# EAGLE design inktime (EAGLE 9.7.0)

## Sheet 1 of 2
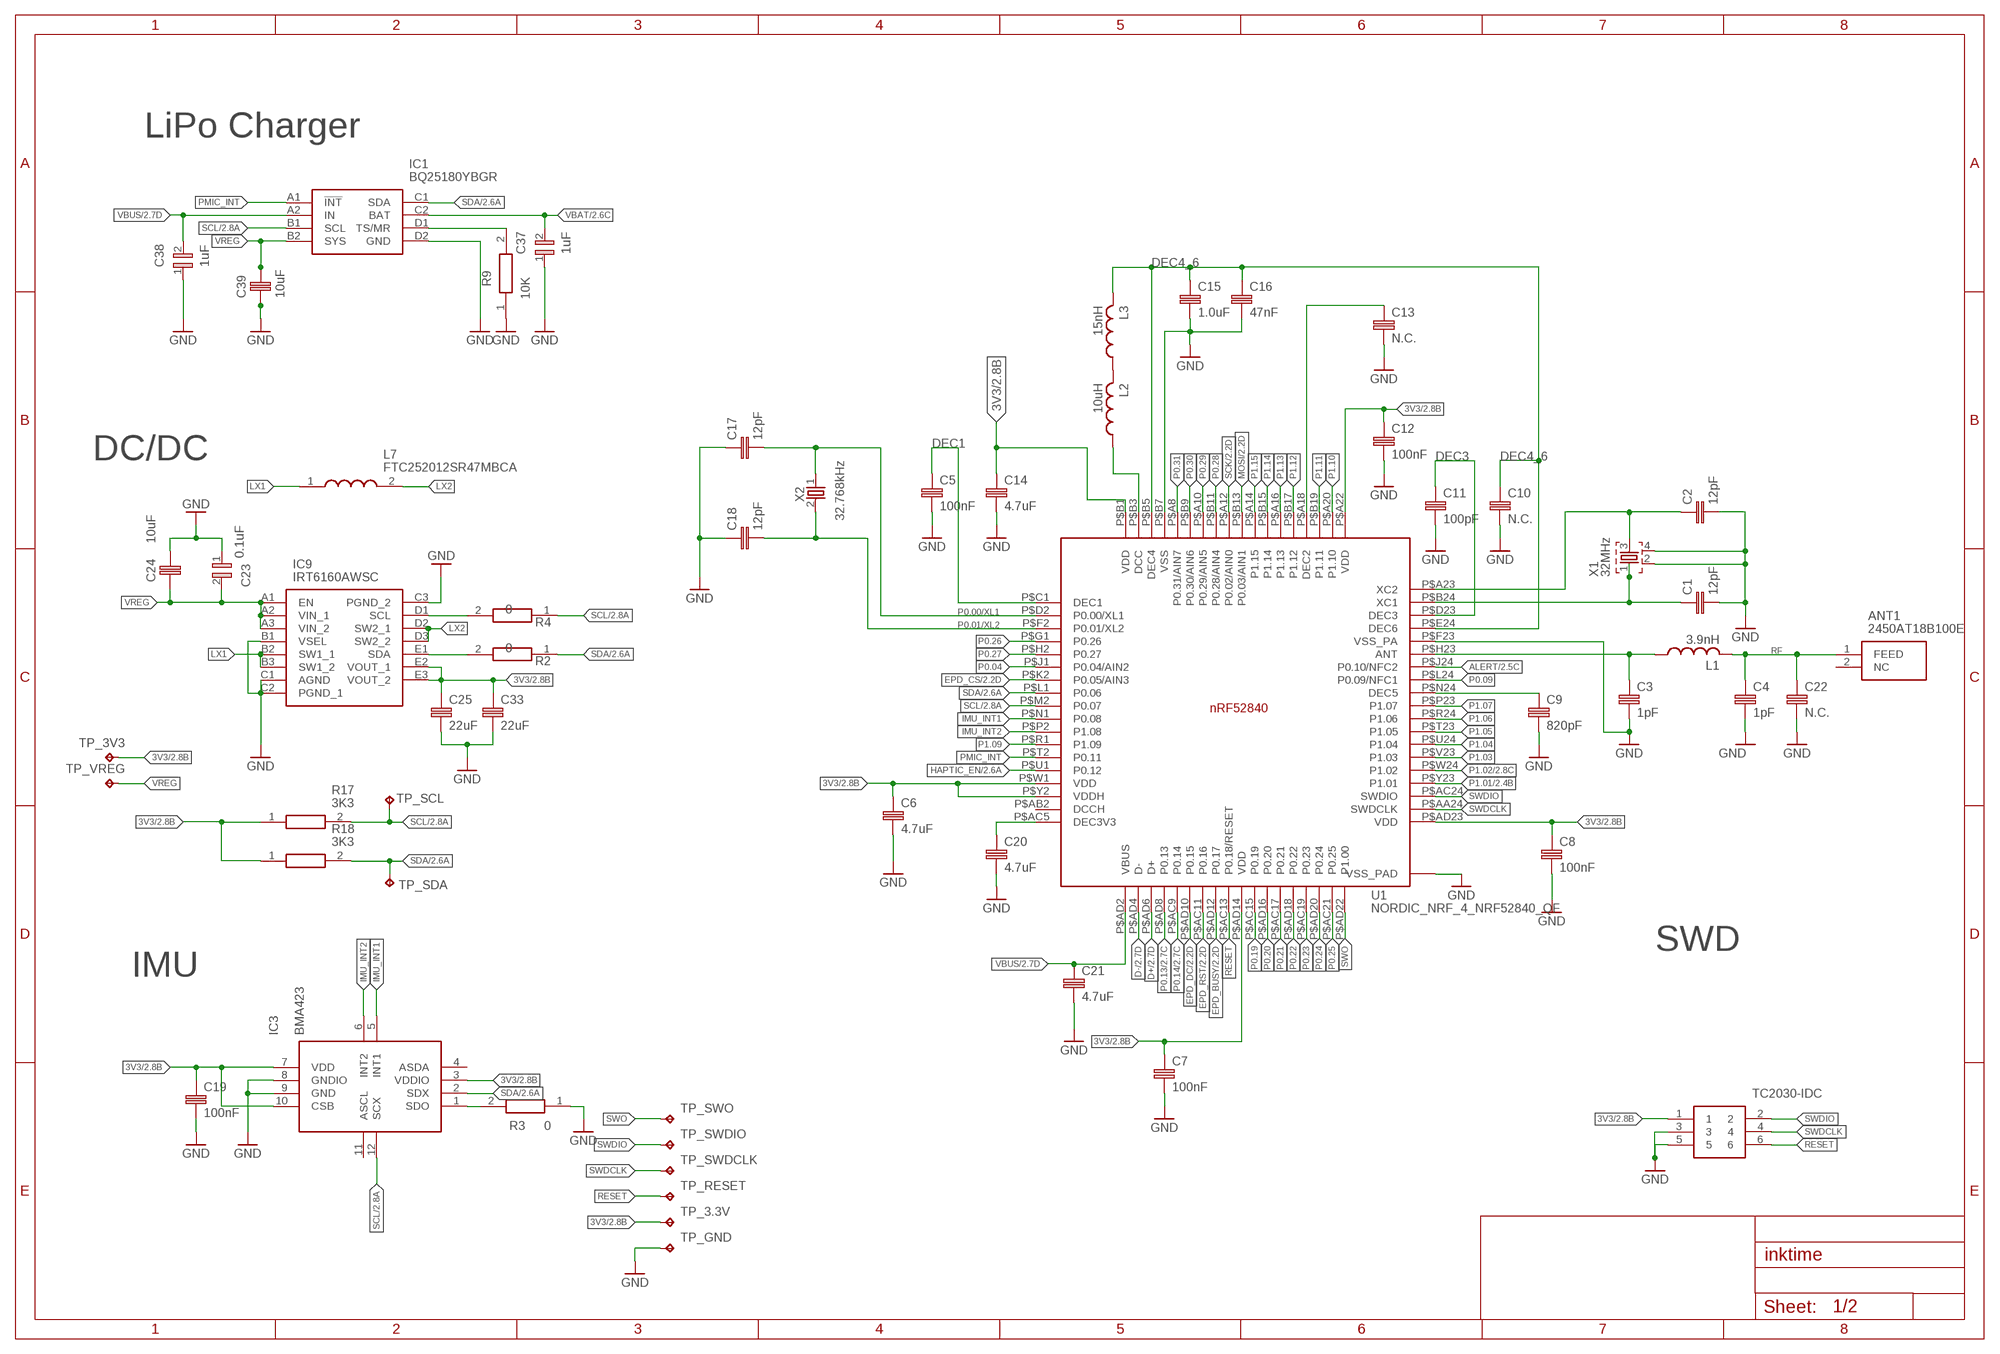
[diagram p0: schematic, sheet 1]

### Parts
ANT1  2450AT18B100E  2450AT18B100E_2450AT18B100E  [2450AT18B100E_ANTC3216X140N]
C1  12pF  NORDIC_NRF_3_CAPACITOR_0201_L  [NORDIC_NRF_3_RESC0201_L]
C2  12pF  NORDIC_NRF_3_CAPACITOR_0201_L  [NORDIC_NRF_3_RESC0201_L]
C3  1pF  NORDIC_NRF_3_CAPACITOR_0201_L  [NORDIC_NRF_3_RESC0201_L]
C4  1pF  NORDIC_NRF_3_CAPACITOR_0201_L  [NORDIC_NRF_3_RESC0201_L]
C5  100nF  NORDIC_NRF_3_CAPACITOR_0201_L  [NORDIC_NRF_3_RESC0201_L]
C6  4.7uF  NORDIC_NRF_3_CAPACITOR_0402_L  [NORDIC_NRF_3_RESC0402_L]
C7  100nF  NORDIC_NRF_3_CAPACITOR_0201_L  [NORDIC_NRF_3_RESC0201_L]
C8  100nF  NORDIC_NRF_3_CAPACITOR_0201_L  [NORDIC_NRF_3_RESC0201_L]
C9  820pF  NORDIC_NRF_3_CAPACITOR_0201_L  [NORDIC_NRF_3_RESC0201_L]
C10  N.C.  NORDIC_NRF_3_CAPACITOR_0201_L  [NORDIC_NRF_3_RESC0201_L]
C11  100pF  NORDIC_NRF_3_CAPACITOR_0201_L  [NORDIC_NRF_3_RESC0201_L]
C12  100nF  NORDIC_NRF_3_CAPACITOR_0201_L  [NORDIC_NRF_3_RESC0201_L]
C13  N.C.  NORDIC_NRF_3_CAPACITOR_0201_L  [NORDIC_NRF_3_RESC0201_L]
C14  4.7uF  NORDIC_NRF_3_CAPACITOR_0402_L  [NORDIC_NRF_3_RESC0402_L]
C15  1.0uF  NORDIC_NRF_3_CAPACITOR_0402_L  [NORDIC_NRF_3_RESC0402_L]
C16  47nF  NORDIC_NRF_3_CAPACITOR_0201_L  [NORDIC_NRF_3_RESC0201_L]
C17  12pF  NORDIC_NRF_3_CAPACITOR_0201_L  [NORDIC_NRF_3_RESC0201_L]
C18  12pF  NORDIC_NRF_3_CAPACITOR_0201_L  [NORDIC_NRF_3_RESC0201_L]
C19  100nF  NORDIC_NRF_3_CAPACITOR_0201_L  [NORDIC_NRF_3_RESC0201_L]
C20  4.7uF  NORDIC_NRF_3_CAPACITOR_0402_L  [NORDIC_NRF_3_RESC0402_L]
C21  4.7uF  NORDIC_NRF_3_CAPACITOR_0402_L  [NORDIC_NRF_3_RESC0402_L]
C22  N.C.  NORDIC_NRF_3_CAPACITOR_0201_L  [NORDIC_NRF_3_RESC0201_L]
C23  0.1uF  GRM011R60J152KE01L_2_GRM011R60J152KE01L  [GRM011R60J152KE01L_2_CAPC0201X13N]
C24  10uF  NORDIC_NRF_3_CAPACITOR_0402_L  [NORDIC_NRF_3_RESC0402_L]
C25  22uF  NORDIC_NRF_3_CAPACITOR_0402_L  [NORDIC_NRF_3_RESC0402_L]
C33  22uF  NORDIC_NRF_3_CAPACITOR_0402_L  [NORDIC_NRF_3_RESC0402_L]
C37  1uF  GRM011R60J152KE01L_2_GRM011R60J152KE01L  [GRM011R60J152KE01L_2_CAPC0201X13N]
C38  1uF  GRM011R60J152KE01L_2_GRM011R60J152KE01L  [GRM011R60J152KE01L_2_CAPC0201X13N]
C39  10uF  NORDIC_NRF_3_CAPACITOR_0402_L  [NORDIC_NRF_3_RESC0402_L]
IC1  BQ25180YBGR  BQ25180YBGR_BQ25180YBGR  [BQ25180YBGR_BGA8C40P2X4_100X155X50]
IC3  BMA423  BMA423_BMA423  [BMA423_BMA423]
IC9  IRT6160AWSC  RT6160AWSC_RT6160AWSC  [RT6160AWSC_BGA15C40P3X5_140X230X60]
J2  TC2030-IDC  TC2030-IDC_TC2030-IDC  [TC2030-IDC_TC2030IDC]
L1  3.9nH  NORDIC_NRF_2_INDUCTOR_0402_L  [NORDIC_NRF_2_RESC0402_L]
L2  10uH  NORDIC_NRF_2_INDUCTOR_0402_L  [NORDIC_NRF_2_RESC0402_L]
L3  15nH  NORDIC_NRF_2_INDUCTOR_0402_L  [NORDIC_NRF_2_RESC0402_L]
L7  FTC252012SR47MBCA  MLP2016SR47MT0S1_FTC252012SR47MBCA  [MLP2016SR47MT0S1_INDC2016X100N]
R2  0  ERA-1AEB3401C_CPF0201D7K68C1  [ERA-1AEB3401C_0201]
R3  0  CPF0201D7K68C1_CPF0201D7K68C1  [CPF0201D7K68C1_0201]
R4  0  ERA-1AEB3401C_CPF0201D7K68C1  [ERA-1AEB3401C_0201]
R9  10K  ERA-1AEB3401C_CPF0201D7K68C1  [ERA-1AEB3401C_0201]
R17  3K3  CPF0201D7K68C1_CPF0201D7K68C1  [CPF0201D7K68C1_0201]
R18  3K3  CPF0201D7K68C1_CPF0201D7K68C1  [CPF0201D7K68C1_0201]
TP_3.3V  HECTOR_WATCH_1_TPTP20R  [HECTOR_WATCH_1_TP20R]
TP_3V3  HECTOR_WATCH_1_TPTP20R  [HECTOR_WATCH_1_TP20R]
TP_GND  HECTOR_WATCH_1_TPTP20R  [HECTOR_WATCH_1_TP20R]
TP_RESET  HECTOR_WATCH_1_TPTP20R  [HECTOR_WATCH_1_TP20R]
TP_SCL  HECTOR_WATCH_1_TPTP20R  [HECTOR_WATCH_1_TP20R]
TP_SDA  HECTOR_WATCH_1_TPTP20R  [HECTOR_WATCH_1_TP20R]
TP_SWDCLK  HECTOR_WATCH_1_TPTP20R  [HECTOR_WATCH_1_TP20R]
TP_SWDIO  HECTOR_WATCH_1_TPTP20R  [HECTOR_WATCH_1_TP20R]
TP_SWO  HECTOR_WATCH_1_TPTP20R  [HECTOR_WATCH_1_TP20R]
TP_VREG  HECTOR_WATCH_1_TPTP20R  [HECTOR_WATCH_1_TP20R]
U1  NORDIC_NRF_4_NRF52840_QF  [NORDIC_NRF_4_AQFN50P700X700X85_HS-74N]
U$3  NORDIC_NRF_3_CAPACITOR_0402_L  [NORDIC_NRF_3_RESC0402_L]
X1  32MHz  NORDIC_NRF_XTAL_32MHZ  [NORDIC_NRF_BT-XTAL_2016_N]
X2  32.768kHz  NORDIC_NRF_1_XTAL_32KHZ  [NORDIC_NRF_1_XTAL_3215_N]

### Nets
3V3: C6.1 C7.1 C8.1 C12.1 C14.1 C19.1 C25.1 C33.1 IC3.3(VDDIO) IC3.7(VDD) IC3.10(CSB) IC9.E2(VOUT_1) IC9.E3(VOUT_2) J2.1 R17.1 R18.1 TP_3.3V.TP TP_3V3.TP U1.P$A22(VDD) U1.P$AD14(VDD) U1.P$AD23(VDD) U1.P$B1(VDD) U1.P$W1(VDD) U1.P$Y2(VDDH) ; also sheet 2
ALERT: U1.P$J24(P0.10/NFC2) ; also sheet 2
D+: U1.P$AD6(D+) ; also sheet 2
D-: U1.P$AD4(D-) ; also sheet 2
DEC1: C5.1 U1.P$C1(DEC1)
DEC3: C11.1 U1.P$D23(DEC3)
DEC4_6: C10.1 C15.1 C16.1 L3.2 U1.P$B5(DEC4) U1.P$E24(DEC6)
EPD_BUSY: U1.P$AD12(P0.17) ; also sheet 2
EPD_CS: U1.P$K2(P0.05/AIN3) ; also sheet 2
EPD_DC: U1.P$AD10(P0.15) ; also sheet 2
EPD_RST: U1.P$AC11(P0.16) ; also sheet 2
GND: C1.2 C2.2 C3.2 C4.2 C5.2 C6.2 C7.2 C8.2 C9.2 C10.2 C11.2 C12.2 C13.2 C14.2 C15.2 C16.2 C17.1 C18.1 C19.2 C20.2 C21.2 C22.2 C23.1 C24.1 C25.2 C33.2 C37.1 C38.1 C39.2 IC1.D2(GND) IC3.8(GNDIO) IC3.9(GND) IC9.B1(VSEL) IC9.C1(AGND) IC9.C2(PGND_1) IC9.C3(PGND_2) J2.3 J2.5 R3.1 R9.1 TP_GND.TP U1.P$74(VSS_PAD) U1.P$75(VSS_PAD) U1.P$76(VSS_PAD) U1.P$77(VSS_PAD) U1.P$78(VSS_PAD) U1.P$79(VSS_PAD) U1.P$80(VSS_PAD) U1.P$81(VSS_PAD) U1.P$82(VSS_PAD) U1.P$83(VSS_PAD) U1.P$84(VSS_PAD) U1.P$85(VSS_PAD) U1.P$86(VSS_PAD) U1.P$87(VSS_PAD) U1.P$88(VSS_PAD) U1.P$89(VSS_PAD) U1.P$90(VSS_PAD) U1.P$B7(VSS) U1.P$F23(VSS_PA) U$3.2 X1.2 X1.4 ; also sheet 2
HAPTIC_EN: U1.P$U1(P0.12) ; also sheet 2
IMU_INT1: IC3.5(INT1) U1.P$N1(P0.08)
IMU_INT2: IC3.6(INT2) U1.P$P2(P1.08)
LX1: IC9.B2(SW1_1) IC9.B3(SW1_2) L7.1
LX2: IC9.D2(SW2_1) IC9.D3(SW2_2) L7.2
MOSI: U1.P$B13(P0.03/AIN1) ; also sheet 2
N$3: C2.1 U1.P$A23(XC2) X1.3
N$4: C1.1 U1.P$B24(XC1) X1.1
N$5: L2.2 L3.1
N$6: L2.1 U1.P$B3(DCC)
N$7: IC3.1(SDO) R3.2
N$8: C3.1 L1.1 U1.P$H23(ANT)
N$10: C13.1 U1.P$A18(DEC2)
N$11: C9.1 U1.P$N24(DEC5)
N$12: C20.1 U1.P$AC5(DEC3V3)
N$16: IC9.D1(SCL) R4.2
N$17: IC1.D1(TS/MR) R9.2
N$19: IC9.E1(SDA) R2.2
P0.00/XL1: C17.2 U1.P$D2(P0.00/XL1) X2.1
P0.01/XL2: C18.2 U1.P$F2(P0.01/XL2) X2.2
P0.04: U1.P$J1(P0.04/AIN2)
P0.09: U1.P$L24(P0.09/NFC1)
P0.13: U1.P$AD8(P0.13) ; also sheet 2
P0.14: U1.P$AC9(P0.14) ; also sheet 2
P0.19: U1.P$AC15(P0.19)
P0.20: U1.P$AD16(P0.20)
P0.21: U1.P$AC17(P0.21)
P0.22: U1.P$AD18(P0.22)
P0.23: U1.P$AC19(P0.23)
P0.24: U1.P$AD20(P0.24)
P0.25: U1.P$AC21(P0.25)
P0.26: U1.P$G1(P0.26)
P0.27: U1.P$H2(P0.27)
P0.28: U1.P$B11(P0.28/AIN4)
P0.29: U1.P$A10(P0.29/AIN5)
P0.30: U1.P$B9(P0.30/AIN6)
P0.31: U1.P$A8(P0.31/AIN7)
P1.01: U1.P$Y23(P1.01) ; also sheet 2
P1.02: U1.P$W24(P1.02) ; also sheet 2
P1.03: U1.P$V23(P1.03)
P1.04: U1.P$U24(P1.04)
P1.05: U1.P$T23(P1.05)
P1.06: U1.P$R24(P1.06)
P1.07: U1.P$P23(P1.07)
P1.09: U1.P$R1(P1.09)
P1.10: U1.P$A20(P1.10)
P1.11: U1.P$B19(P1.11)
P1.12: U1.P$B17(P1.12)
P1.13: U1.P$A16(P1.13)
P1.14: U1.P$B15(P1.14)
P1.15: U1.P$A14(P1.15)
PMIC_INT: IC1.A1(!INT) U1.P$T2(P0.11)
RESET: J2.6 TP_RESET.TP U1.P$AC13(P0.18/RESET)
RF: ANT1.1(FEED) C4.1 C22.1 L1.2
SCK: U1.P$A12(P0.02/AIN0) ; also sheet 2
SCL: IC1.B1(SCL) IC3.12(SCX) R4.1 R17.2 TP_SCL.TP U1.P$M2(P0.07) ; also sheet 2
SDA: IC1.C1(SDA) IC3.2(SDX) R2.1 R18.2 TP_SDA.TP U1.P$L1(P0.06) ; also sheet 2
SWDCLK: J2.4 TP_SWDCLK.TP U1.P$AA24(SWDCLK)
SWDIO: J2.2 TP_SWDIO.TP U1.P$AC24(SWDIO)
SWO: TP_SWO.TP U1.P$AD22(P1.00)
VBAT: C37.2 IC1.C2(BAT) ; also sheet 2
VBUS: C21.1 C38.2 IC1.A2(IN) U1.P$AD2(VBUS) ; also sheet 2
VREG: C23.2 C24.2 C39.1 IC1.B2(SYS) IC9.A1(EN) IC9.A2(VIN_1) IC9.A3(VIN_2) TP_VREG.TP U$3.1
Unconnected: ANT1.2(NC) IC3.4(ASDA) IC3.11(ASCL) U1.P$AB2(DCCH)

### Notes on the sheet
- LiPo Charger
- DC/DC
- SWD
- IMU

## Sheet 2 of 2
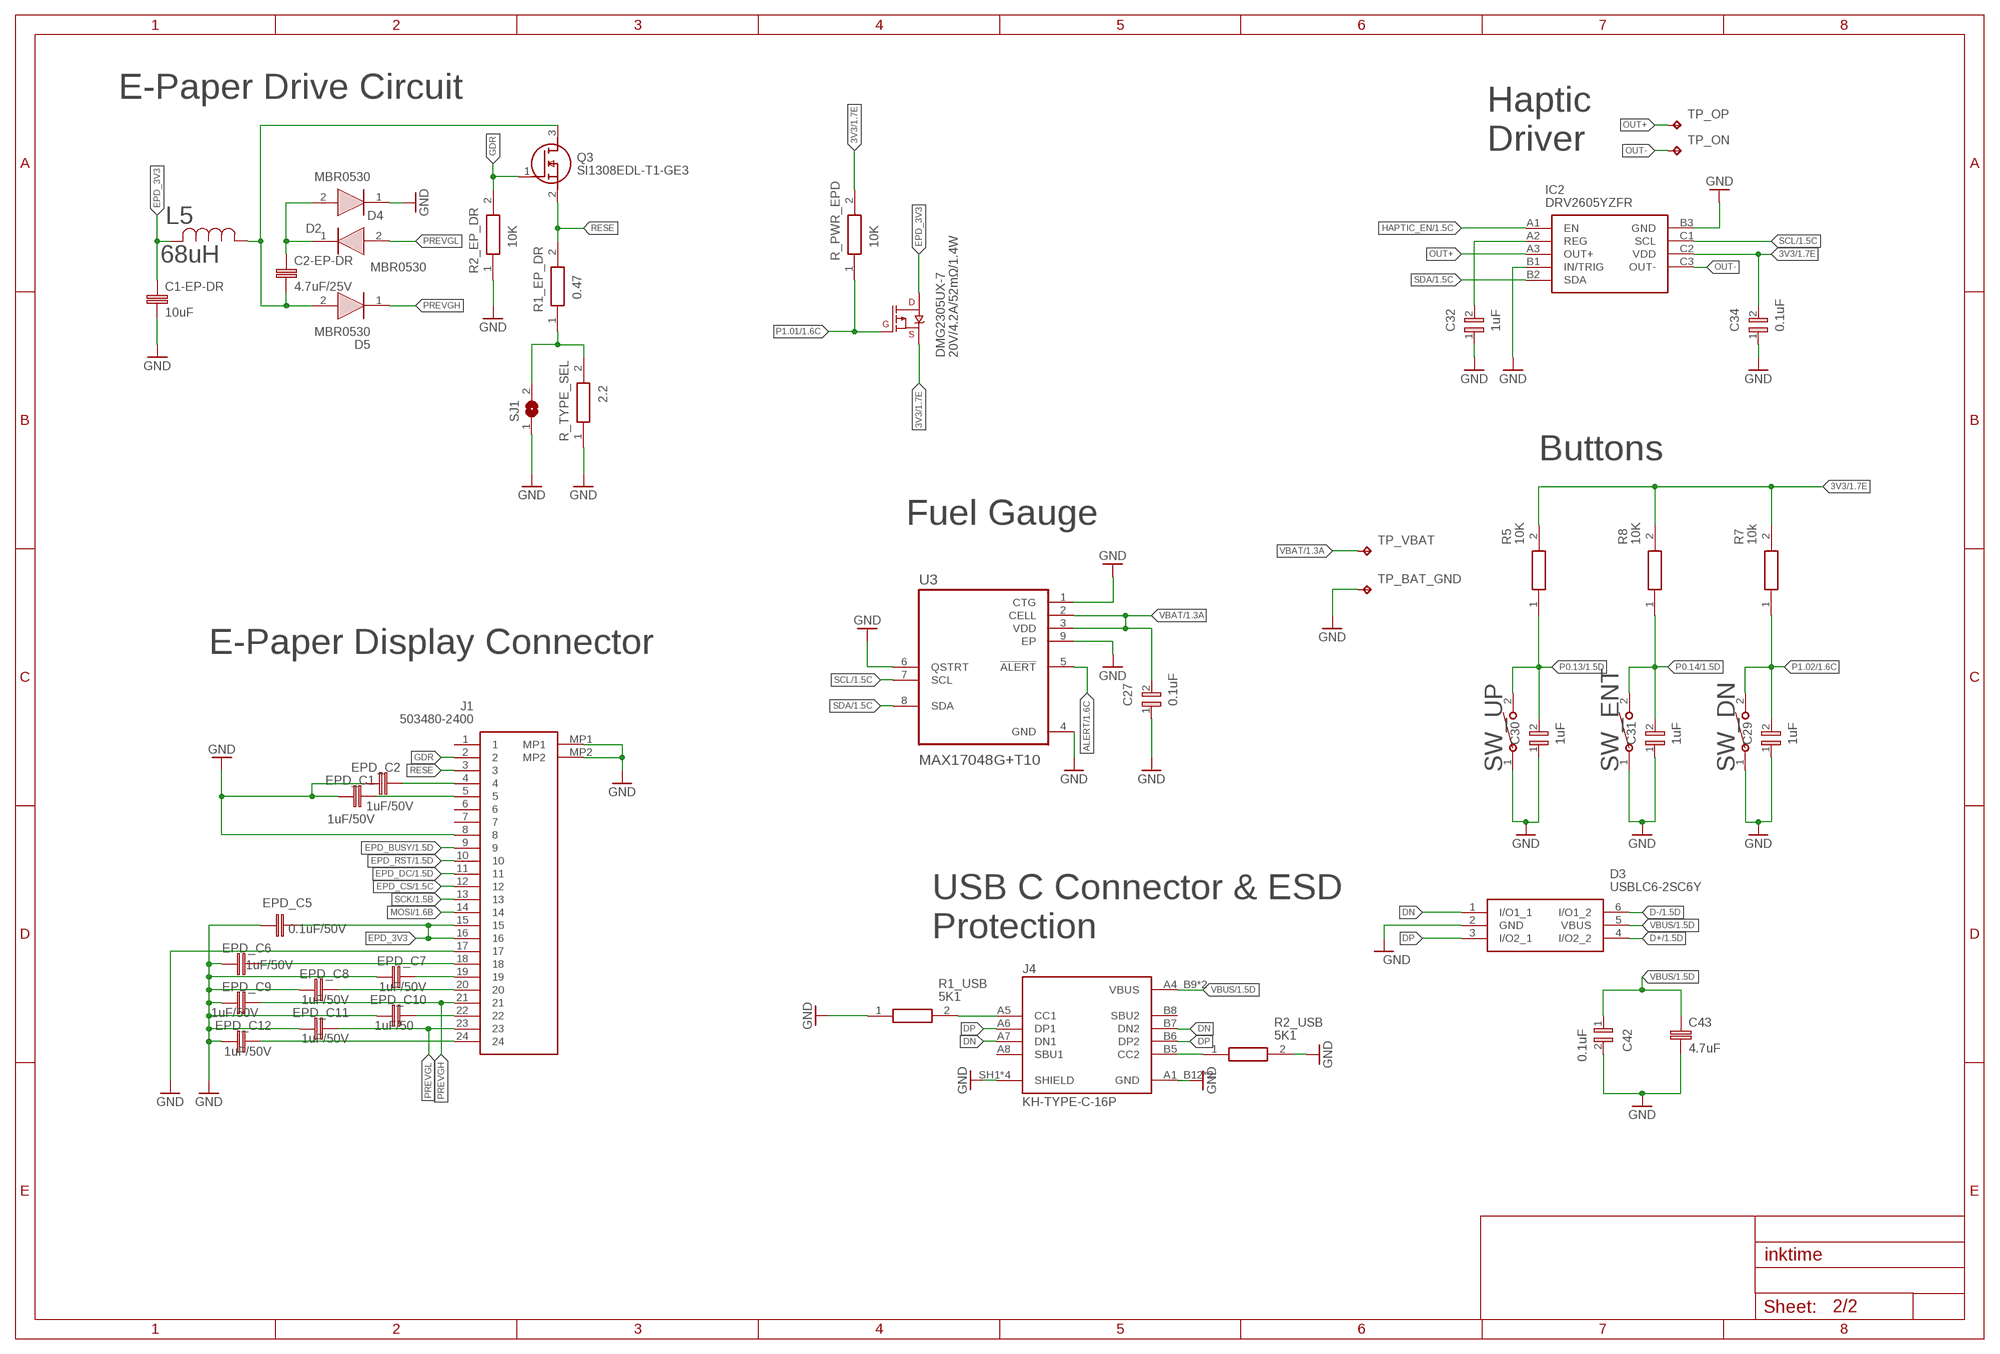
[diagram p1: schematic, sheet 2]

### Parts
C1-EP-DR  10uF  NORDIC_NRF_3_CAPACITOR_0402_L  [NORDIC_NRF_3_RESC0402_L]
C2-EP-DR  4.7uF/25V  NORDIC_NRF_3_CAPACITOR_0402_L  [NORDIC_NRF_3_RESC0402_L]
C27  0.1uF  GRM011R60J152KE01L_2_GRM011R60J152KE01L  [GRM011R60J152KE01L_2_CAPC0201X13N]
C29  1uF  GRM011R60J152KE01L_2_GRM011R60J152KE01L  [GRM011R60J152KE01L_2_CAPC0201X13N]
C30  1uF  GRM011R60J152KE01L_2_GRM011R60J152KE01L  [GRM011R60J152KE01L_2_CAPC0201X13N]
C31  1uF  GRM011R60J152KE01L_2_GRM011R60J152KE01L  [GRM011R60J152KE01L_2_CAPC0201X13N]
C32  1uF  GRM011R60J152KE01L_2_GRM011R60J152KE01L  [GRM011R60J152KE01L_2_CAPC0201X13N]
C34  0.1uF  GRM011R60J152KE01L_2_GRM011R60J152KE01L  [GRM011R60J152KE01L_2_CAPC0201X13N]
C42  0.1uF  GRM011R60J152KE01L_2_GRM011R60J152KE01L  [GRM011R60J152KE01L_2_CAPC0201X13N]
C43  4.7uF  NORDIC_NRF_3_CAPACITOR_0402_L  [NORDIC_NRF_3_RESC0402_L]
D2  MBR0530  ESP32_C6_LIBRARY_5_MBR0530  [ESP32_C6_LIBRARY_5_SOD3716X135N]
D3  USBLC6-2SC6Y  ESP32_C6_LIBRARY_3_USBLC6-2SC6Y  [ESP32_C6_LIBRARY_3_SOT95P280X145-6N]
D4  MBR0530  ESP32_C6_LIBRARY_5_MBR0530  [ESP32_C6_LIBRARY_5_SOD3716X135N]
D5  MBR0530  ESP32_C6_LIBRARY_5_MBR0530  [ESP32_C6_LIBRARY_5_SOD3716X135N]
DMG2305UX-7  20V/4.2A/52mΩ/1.4W  ESP32_C6_LIBRARY_4_ESP32_WROVER_SPARKFUN-DISCRETESEMI_MOSFET_PCH-DMG2305UX-7  [ESP32_C6_LIBRARY_4_ESP32_C6_LIBRARY_4_ESP32_C6_LIBRARY_4_ESP32_C6_LIBRARY_4_ESP32_WROVER_SPARKFUN-DISCRETESEMI_SOT23-3]
EPD_C1  1uF/50V  NORDIC_NRF_3_CAPACITOR_0402_L  [NORDIC_NRF_3_RESC0402_L]
EPD_C2  1uF/50V  NORDIC_NRF_3_CAPACITOR_0402_L  [NORDIC_NRF_3_RESC0402_L]
EPD_C5  0.1uF/50V  NORDIC_NRF_3_CAPACITOR_0201_L  [NORDIC_NRF_3_RESC0201_L]
EPD_C6  1uF/50V  NORDIC_NRF_3_CAPACITOR_0402_L  [NORDIC_NRF_3_RESC0402_L]
EPD_C7  1uF/50V  NORDIC_NRF_3_CAPACITOR_0402_L  [NORDIC_NRF_3_RESC0402_L]
EPD_C8  1uF/50V  NORDIC_NRF_3_CAPACITOR_0402_L  [NORDIC_NRF_3_RESC0402_L]
EPD_C9  1uF/50V  NORDIC_NRF_3_CAPACITOR_0402_L  [NORDIC_NRF_3_RESC0402_L]
EPD_C10  1uF/50  NORDIC_NRF_3_CAPACITOR_0402_L  [NORDIC_NRF_3_RESC0402_L]
EPD_C11  1uF/50V  NORDIC_NRF_3_CAPACITOR_0402_L  [NORDIC_NRF_3_RESC0402_L]
EPD_C12  1uF/50V  NORDIC_NRF_3_CAPACITOR_0402_L  [NORDIC_NRF_3_RESC0402_L]
IC2  DRV2605YZFR  DRV2605YZFR_DRV2605YZFR  [DRV2605YZFR_BGA9C50P3X3_144X144X62]
J1  503480-2400  503480-2400_503480-2400  [503480-2400_5034802400]
J4  KH-TYPE-C-16P  KH-TYPE-C-16P_KH-TYPE-C-16P  [KH-TYPE-C-16P_KINGHELM_KH-TYPE-C-16P]
L5  68uH  ESP32_C6_LIBRARY_2_744043680IND_4828-WE-TPC_WRE  [ESP32_C6_LIBRARY_2_IND_4828-WE-TPC_WRE]
Q3  SI1308EDL-T1-GE3  ESP32_C6_LIBRARY_6_SI1308EDL-T1-GE3  [ESP32_C6_LIBRARY_6_SOT65P210X110-3N]
R1_EP_DR  0.47  ERA-1AEB3401C_CPF0201D7K68C1  [ERA-1AEB3401C_0201]
R1_USB  5K1  ERA-1AEB3401C_CPF0201D7K68C1  [ERA-1AEB3401C_0201]
R2_EP_DR  10K  ERA-1AEB3401C_CPF0201D7K68C1  [ERA-1AEB3401C_0201]
R2_USB  5K1  ERA-1AEB3401C_CPF0201D7K68C1  [ERA-1AEB3401C_0201]
R5  10K  ERA-1AEB3401C_CPF0201D7K68C1  [ERA-1AEB3401C_0201]
R7  10k  ERA-1AEB3401C_CPF0201D7K68C1  [ERA-1AEB3401C_0201]
R8  10K  ERA-1AEB3401C_CPF0201D7K68C1  [ERA-1AEB3401C_0201]
R_PWR_EPD  10K  ERA-1AEB3401C_CPF0201D7K68C1  [ERA-1AEB3401C_0201]
R_TYPE_SEL  2.2  ERA-1AEB3401C_CPF0201D7K68C1  [ERA-1AEB3401C_0201]
SJ1  ESP32_C6_LIBRARY_7_JUMPER_SJ  [ESP32_C6_LIBRARY_7_JUMPER_SJ]
SW_DN  2025-10-22_07-23-44_LIBRARY_EVP-AKE31ASW_EVP-AKE31A_PAN  [2025-10-22_07-23-44_LIBRARY_SW_EVP-AKE31A_PAN]
SW_ENT  2025-10-22_07-23-44_LIBRARY_EVP-AKE31ASW_EVP-AKE31A_PAN  [2025-10-22_07-23-44_LIBRARY_SW_EVP-AKE31A_PAN]
SW_UP  2025-10-22_07-23-44_LIBRARY_EVP-AKE31ASW_EVP-AKE31A_PAN  [2025-10-22_07-23-44_LIBRARY_SW_EVP-AKE31A_PAN]
TP_BAT_GND  HECTOR_WATCH_1_TPTP20R  [HECTOR_WATCH_1_TP20R]
TP_ON  HECTOR_WATCH_1_TPTP20R  [HECTOR_WATCH_1_TP20R]
TP_OP  HECTOR_WATCH_1_TPTP20R  [HECTOR_WATCH_1_TP20R]
TP_VBAT  HECTOR_WATCH_1_TPTP20R  [HECTOR_WATCH_1_TP20R]
U3  MAX17048G+T10  ESP32_C6_LIBRARY_MAX17048G+T10  [ESP32_C6_LIBRARY_SON50P200X200X80-9N]

### Nets
3V3: C34.2 DMG2305UX-7.2(S) IC2.C2(VDD) R5.2 R7.2 R8.2 R_PWR_EPD.2 ; also sheet 1
ALERT: U3.5(!ALERT) ; also sheet 1
D+: D3.4(I/O2_2) ; also sheet 1
D-: D3.6(I/O1_2) ; also sheet 1
DN: D3.1(I/O1_1) J4.A7(DN1) J4.B7(DN2)
DP: D3.3(I/O2_1) J4.A6(DP1) J4.B6(DP2)
EPD_3V3: C1-EP-DR.1 DMG2305UX-7.3(D) EPD_C5.1 J1.15 J1.16 L5.2
EPD_BUSY: J1.9 ; also sheet 1
EPD_CS: J1.12 ; also sheet 1
EPD_DC: J1.11 ; also sheet 1
EPD_RST: J1.10 ; also sheet 1
GDR: J1.2 Q3.1(G) R2_EP_DR.2
GND: C1-EP-DR.2 C27.1 C29.1 C30.1 C31.1 C32.1 C34.1 C42.2 C43.2 D3.2(GND) D4.1(K) EPD_C1.1 EPD_C2.1 EPD_C5.2 EPD_C6.1 EPD_C7.1 EPD_C8.1 EPD_C9.1 EPD_C10.1 EPD_C11.1 EPD_C12.1 IC2.B1(IN/TRIG) IC2.B3(GND) J1.8 J1.17 J1.MP1 J1.MP2 J4.A1_B12(GND) J4.A12_B1(GND) J4.SH1(SHIELD) J4.SH2(SHIELD) J4.SH3(SHIELD) J4.SH4(SHIELD) R1_USB.1 R2_EP_DR.1 R2_USB.2 R_TYPE_SEL.1 SJ1.1 SW_DN.1 SW_ENT.1 SW_UP.1 TP_BAT_GND.TP U3.1(CTG) U3.4(GND) U3.6(QSTRT) U3.9(EP) ; also sheet 1
HAPTIC_EN: IC2.A1(EN) ; also sheet 1
MOSI: J1.14 ; also sheet 1
N$1: C32.2 IC2.A2(REG)
N$2: C2-EP-DR.2 D5.2(A) L5.1 Q3.3(D)
N$9: C2-EP-DR.1 D2.1(K) D4.2(A)
N$13: J4.B5(CC2) R2_USB.1
N$14: J4.A5(CC1) R1_USB.2
N$15: EPD_C2.2 J1.4
N$18: EPD_C1.2 J1.5
N$20: R1_EP_DR.1 R_TYPE_SEL.2 SJ1.2
N$28: EPD_C6.2 J1.18
N$29: EPD_C7.2 J1.19
N$30: EPD_C8.2 J1.20
N$32: EPD_C10.2 J1.22
N$34: EPD_C12.2 J1.24
OUT+: IC2.A3(OUT+) TP_OP.TP
OUT-: IC2.C3(OUT-) TP_ON.TP
P0.13: C30.2 R5.1 SW_UP.2 ; also sheet 1
P0.14: C31.2 R8.1 SW_ENT.2 ; also sheet 1
P1.01: DMG2305UX-7.1(G) R_PWR_EPD.1 ; also sheet 1
P1.02: C29.2 R7.1 SW_DN.2 ; also sheet 1
PREVGH: D5.1(K) EPD_C9.2 J1.21
PREVGL: D2.2(A) EPD_C11.2 J1.23
RESE: J1.3 Q3.2(S) R1_EP_DR.2
SCK: J1.13 ; also sheet 1
SCL: IC2.C1(SCL) U3.7(SCL) ; also sheet 1
SDA: IC2.B2(SDA) U3.8(SDA) ; also sheet 1
VBAT: C27.2 TP_VBAT.TP U3.2(CELL) U3.3(VDD) ; also sheet 1
VBUS: C42.1 C43.1 D3.5(VBUS) J4.A4_B9(VBUS) J4.A9_B4(VBUS) ; also sheet 1
Unconnected: J1.1 J1.6 J1.7 J4.A8(SBU1) J4.B8(SBU2)

### Notes on the sheet
- E-Paper Drive Circuit
- Haptic 
  Driver
- Buttons
- Fuel Gauge
- E-Paper Display Connector
- USB C Connector & ESD
  Protection

## Library data of the parts
ANT1 = InkTime_v5:2450AT18B100E_2450AT18B100E: Antennas 2.45GHz ANTENNA Source: Datasheet <https://www.johansontechnology.com/datasheets/2450AT18B100/2450AT18B100.pdf>; ARROW_PART_NUMBER: 2450AT18B100E; ARROW_PRICE-STOCK: https://www.arrow.com/en/products/2450at18b100e/johanson-dielectrics?utm_currency=USD&region=nac; DESCRIPTION: Antennas 2.45GHz ANTENNA; HEIGHT: 1.4mm; MANUFACTURER_NAME: JOHANSON TECHNOLOGY; MANUFACTURER_PART_NUMBER: 2450AT18B100E; MOUSER_PART_NUMBER: 609-2450AT18B100E; MOUSER_PRICE-STOCK: https://www.mouser.co.uk/ProductDetail/Johanson-Technology/2450AT18B100E?qs=yCnrNFeXz%252Bh5MFsFIXGZGA%3D%3D
C1 C1-EP-DR C2 C2-EP-DR C3-C22 C24 C25 C33 C39 C43 EPD_C1 EPD_C2 EPD_C5-EPD_C12 U$3 = InkTime_v5:NORDIC_NRF_3_CAPACITOR: Generic chip capacitor
C23 C27 C29-C32 C34 C37 C38 C42 = InkTime_v5:GRM011R60J152KE01L_2_GRM011R60J152KE01L: Check availability <https://pricing.snapeda.com/parts/GRM011R60J152KE01L/Murata/view-part?ref=eda>; AVAILABILITY: In Stock; CHECK_PRICES: https://www.snapeda.com/parts/GRM011R60J152KE01L/Murata/view-part/?ref=eda; DESCRIPTION: SMD Capacitor X5R(EIA) with Capacitance: 1500pF Tol. 10%. Rated Voltage: 6.3Vdc; MF: Murata; MP: GRM011R60J152KE01L; PACKAGE: 0201 Murata; PRICE: None; SNAPEDA_LINK: https://www.snapeda.com/parts/GRM011R60J152KE01L/Murata/view-part/?ref=snap
D2 D4 D5 = InkTime_v5:ESP32_C6_LIBRARY_5_MBR0530: ON SEMICONDUCTOR - MBR0530 - DIODE, SCHOTTKY, 0.5A, 30V, SOD-123 Source: Datasheet <http://www.onsemi.com/pub/Collateral/MBR0530T1-D.PDF> Check availability <https://pricing.snapeda.com/parts/MBR0530/ON%20Semiconductor/view-part?ref=eda>; AVAILABILITY: In Stock; CHECK_PRICES: https://www.snapeda.com/parts/MBR0530/Onsemi/view-part/?ref=eda; DESCRIPTION: Diode Schottky 30 V 500mA Surface Mount SOD-123; MF: ON Semiconductor; MP: MBR0530; PACKAGE: SOD-123-2 ON Semiconductor; PRICE: None; PURCHASE-URL: https://www.snapeda.com/api/url_track_click_mouser/?unipart_id=179458&manufacturer=ON Semiconductor&part_name=MBR0530&search_term=None; SNAPEDA_LINK: https://www.snapeda.com/parts/MBR0530/Onsemi/view-part/?ref=snap
D3 = InkTime_v5:ESP32_C6_LIBRARY_3_USBLC6-2SC6Y: Low Cap. ESD Protection Auto SOT-23-6 STMicroelectronics USBLC6-2SC6Y, Dual Uni-Directional TVS Diode Array, 6-Pin SOT-23 Source: Datasheet <https://componentsearchengine.com/Datasheets/1/USBLC6-2SC6Y.pdf> Check availability <https://pricing.snapeda.com/parts/USBLC6-2SC6Y/STMicroelectronics/view-part?ref=eda>; AVAILABILITY: In Stock; CHECK_PRICES: https://www.snapeda.com/parts/USBLC6-2SC6Y/STMicroelectronics/view-part/?ref=eda; DESCRIPTION: 17V Clamp 5A (8/20µs) Ipp Tvs Diode Surface Mount SOT-23-6; MF: STMicroelectronics; MP: USBLC6-2SC6Y; PACKAGE: SOT-23-6 STMicroelectronics; PRICE: None; SNAPEDA_LINK: https://www.snapeda.com/parts/USBLC6-2SC6Y/STMicroelectronics/view-part/?ref=snap
DMG2305UX-7 = InkTime_v5:ESP32_C6_LIBRARY_4_ESP32_WROVER_SPARKFUN-DISCRETESEMI_MOSFET_PCH: P-channel MOSFETs Voltage controlled devices that allow control of high current outputs. SparkFun Products: SparkFun ESP32 Thing <https://www.sparkfun.com/products/13907> SparkFun ESP8266 Thing <https://www.sparkfun.com/products/13231> SparkFun Pi Servo HAT V2 <https://www.sparkfun.com/products/15316> DMG2305UX-7 (20V/4.2A/SOT23-3); PROD_ID: TRAN-14388
IC1 = InkTime_v5:BQ25180YBGR_BQ25180YBGR: Charger IC Lithium Ion/Polymer, Lithium Iron Phosphate 8-DSBGA (1.6x1.1) Source: Datasheet <https://www.ti.com/lit/ds/symlink/bq25180.pdf?ts=1650264094470&ref_url=https%3A%2F%2Fwww.ti.com%2Fproduct%2FBQ25180>; ARROW_PART_NUMBER: BQ25180YBGR; ARROW_PRICE-STOCK: https://www.arrow.com/en/products/bq25180ybgr/texas-instruments?utm_currency=USD&region=nac; DESCRIPTION: Charger IC Lithium Ion/Polymer, Lithium Iron Phosphate 8-DSBGA (1.6x1.1); HEIGHT: 0.5mm; MANUFACTURER_NAME: Texas Instruments; MANUFACTURER_PART_NUMBER: BQ25180YBGR; MOUSER_PART_NUMBER: 595-BQ25180YBGR; MOUSER_PRICE-STOCK: https://www.mouser.co.uk/ProductDetail/Texas-Instruments/BQ25180YBGR?qs=doiCPypUmgEWjAK%252BJAX6Tw%3D%3D
IC2 = InkTime_v5:DRV2605YZFR_DRV2605YZFR: Haptic Driver for ERM/LRA with Built-In Library and Smart Loop Architecture Source: Datasheet <http://www.ti.com/lit/gpn/drv2605>; ARROW_PART_NUMBER: DRV2605YZFR; ARROW_PRICE-STOCK: https://www.arrow.com/en/products/drv2605yzfr/texas-instruments?region=nac; DESCRIPTION: Haptic Driver for ERM/LRA with Built-In Library and Smart Loop Architecture; HEIGHT: 0.625mm; MANUFACTURER_NAME: Texas Instruments; MANUFACTURER_PART_NUMBER: DRV2605YZFR
IC3 = InkTime_v5:BMA423_BMA423: Accelerometers Triaxial low-g 12bit Acceleration Sensor Source: Datasheet <https://www.mouser.com/datasheet/2/783/BST-BMA423-DS000-1509600.pdf>; ARROW_PART_NUMBER: BMA423; ARROW_PRICE-STOCK: https://www.arrow.com/en/products/bma423/bosch; DESCRIPTION: Accelerometers Triaxial low-g 12bit Acceleration Sensor; HEIGHT: 1mm; MANUFACTURER_NAME: BOSCH; MANUFACTURER_PART_NUMBER: BMA423; MOUSER_PART_NUMBER: 262-BMA423; MOUSER_PRICE-STOCK: https://www.mouser.co.uk/ProductDetail/Bosch-Sensortec/BMA423?qs=HXFqYaX1Q2xC%252BSgeGoX3mg%3D%3D
IC9 = InkTime_v5:RT6160AWSC_RT6160AWSC: Buck-Boost Regulator Positive Output Step-Up/Step-Down I2C DC-DC Controller IC 15-WL-CSP (BSC) (1.4x2.3) Source: Datasheet <https://www.richtek.com/SaveDownload.aspx?specid=RT6160A>; DESCRIPTION: Buck-Boost Regulator Positive Output Step-Up/Step-Down I2C DC-DC Controller IC 15-WL-CSP (BSC) (1.4x2.3); HEIGHT: 0.6mm; MANUFACTURER_NAME: RICHTEK; MANUFACTURER_PART_NUMBER: RT6160AWSC; MOUSER_PART_NUMBER: 835-RT6160AWSC; MOUSER_PRICE-STOCK: https://www.mouser.co.uk/ProductDetail/Richtek/RT6160AWSC?qs=amGC7iS6iy%2FLd9PSoixZXQ%3D%3D
J1 = InkTime_v5:503480-2400_503480-2400: FFC & FPC Connectors 0.5mm FPC RA SMT Dual Contact 24Ckt Source: Datasheet <https://componentsearchengine.com/Datasheets/1/503480-2400.pdf>; DESCRIPTION: FFC & FPC Connectors 0.5mm FPC RA SMT Dual Contact 24Ckt; HEIGHT: 1.87mm; MANUFACTURER_NAME: Molex; MANUFACTURER_PART_NUMBER: 503480-2400; MOUSER_PART_NUMBER: 538-503480-2400; MOUSER_PRICE-STOCK: https://www.mouser.co.uk/ProductDetail/Molex/503480-2400?qs=OAhjpuo3Vu7efIoxFh9AOw%3D%3D
J2 = InkTime_v5:TC2030-IDC_TC2030-IDC: CABLE ADAPTER 6 POS Source: Datasheet <https://datasheet.datasheetarchive.com/originals/distributors/Datasheets_SAMA/62bc384e093448baaaa63dbd0b9d8707.pdf>; DESCRIPTION: CABLE ADAPTER 6 POS; HEIGHT: 19mm; MANUFACTURER_NAME: Tag Connect; MANUFACTURER_PART_NUMBER: TC2030-IDC
J4 = InkTime_v5:KH-TYPE-C-16P_KH-TYPE-C-16P: Check availability <https://pricing.snapeda.com/parts/KH-TYPE-C-16P/kinghelm/view-part?ref=eda>; AVAILABILITY: Not in stock; CHECK_PRICES: https://www.snapeda.com/parts/KH-TYPE-C-16P/Kinghelm/view-part/?ref=eda; MF: kinghelm; MP: KH-TYPE-C-16P; PACKAGE: None; PRICE: None; SNAPEDA_LINK: https://www.snapeda.com/parts/KH-TYPE-C-16P/Kinghelm/view-part/?ref=snap
L1-L3 = InkTime_v5:NORDIC_NRF_2_INDUCTOR: Generic chip inductor
L5 = InkTime_v5:ESP32_C6_LIBRARY_2_744043680; COPYRIGHT: Copyright (C) 2024 Ultra Librarian. All rights reserved.; MANUFACTURER_PART_NUMBER: 744043680; MFR_NAME: Wurth Electronics
L7 = InkTime_v5:MLP2016SR47MT0S1_FTC252012SR47MBCA: SMD / SMT Inductors (Coils), L=0.47?H, L x W x T : Source: Datasheet <https://product.tdk.com/system/files/dam/doc/product/inductor/inductor/smd/catalog/inductor_commercial_power_mlp2016_en.pdf>; DESCRIPTION: SMD / SMT Inductors (Coils), L=0.47?H, L x W x T :; HEIGHT: 1mm; JLCPCB: https://jlcpcb.com/partdetail/6763488-FTC252012SR47MBCA/C5832368; MANUFACTURER_NAME: TDK; MANUFACTURER_PART_NUMBER: FTC252012SR47MBCA
Q3 = InkTime_v5:ESP32_C6_LIBRARY_6_SI1308EDL-T1-GE3: MOSFET N-Ch 30V 1.5A TrenchFET SC70 Vishay Si1308EDL-T1-GE3 N-channel MOSFET Transistor, 1.5 A, 30 V, 3-Pin SC-70 Source: Datasheet <https://componentsearchengine.com/Datasheets/1/SI1308EDL-T1-GE3.pdf> Check availability <https://pricing.snapeda.com/parts/SI1308EDL-T1-GE3/Vishay%20Siliconix/view-part?ref=eda>; AVAILABILITY: In Stock; CHECK_PRICES: https://www.snapeda.com/parts/SI1308EDL-T1-GE3/Vishay+Siliconix/view-part/?ref=eda; DESCRIPTION: Si1308EDL-T1-GE3 N-channel MOSFET Transistor, 1.5 A, 30 V, 3-Pin SC-70 | Siliconix / Vishay SI1308EDL-T1-GE3; MF: Vishay Siliconix; MP: SI1308EDL-T1-GE3; PACKAGE: SOT-323 Vishay Semiconductor; PRICE: None; PURCHASE-URL: https://www.snapeda.com/api/url_track_click_mouser/?unipart_id=274603&manufacturer=Vishay Siliconix&part_name=SI1308EDL-T1-GE3&search_term=None; SNAPEDA_LINK: https://www.snapeda.com/parts/SI1308EDL-T1-GE3/Vishay+Siliconix/view-part/?ref=snap
R1_EP_DR R1_USB R2 R2_EP_DR R2_USB R4 R5 R7-R9 R_PWR_EPD R_TYPE_SEL = InkTime_v5:ERA-1AEB3401C_CPF0201D7K68C1: 7.68k 0201 Thin Film Surface Mount Fixed Resistor +/-0.5% 0.031W CPF0201D7K68C1 Source: Datasheet <http://www.te.com/commerce/DocumentDelivery/DDEController?Action=showdoc&DocId=Data Sheet1773200-1ApdfEnglishENG_DS_1773200-1_A.pdf4-2176215-6>
R3 R17 R18 = InkTime_v5:CPF0201D7K68C1_CPF0201D7K68C1: 7.68k 0201 Thin Film Surface Mount Fixed Resistor +/-0.5% 0.031W CPF0201D7K68C1 Source: Datasheet <http://www.te.com/commerce/DocumentDelivery/DDEController?Action=showdoc&DocId=Data Sheet1773200-1ApdfEnglishENG_DS_1773200-1_A.pdf4-2176215-6>
SJ1 = InkTime_v5:ESP32_C6_LIBRARY_7_JUMPER_SJ: SMD solder JUMPER
SW_DN SW_ENT SW_UP = InkTime_v5:2025-10-22_07-23-44_LIBRARY_EVP-AKE31A; COPYRIGHT: Copyright (C) 2025 Ultra Librarian. All rights reserved.; DIGI-KEY_PART_NUMBER_1: P123437TR-ND; DIGI-KEY_PART_NUMBER_2: P123437CT-ND; DIGI-KEY_PART_NUMBER_3: P123437DKR-ND; MANUFACTURER_NAME: Panasonic; MANUFACTURER_PART_NUMBER: EVP-AKE31A
TP_3.3V TP_3V3 TP_BAT_GND TP_GND TP_ON TP_OP TP_RESET TP_SCL TP_SDA TP_SWDCLK TP_SWDIO TP_SWO TP_VBAT TP_VREG = InkTime_v5:HECTOR_WATCH_1_TP: Test pad
U1 = InkTime_v5:NORDIC_NRF_4_NRF52840_QF: nRF52840 Features Advanced Single chip 2.4 GHz multi-protocol SoC 32-bit ARM Cortex-M4F Processor 1.7v to 5.5v operation 1MB flash + 256kB RAM Bluetooth 5 support for long range and high throughput 802.15.4 radio support On-chip NFC PPI –Programmable Peripheral Interconnect Automated power management system with automatic power management of each peripheral Configurable I/O mapping for analog and digital I/O 48 x GPIO 1 x QSPI 4 x Master/Slave SPI 2 x Two-wire interface (I²C) I²S interface 2 x UART 4 x PWM USB 2.0 controller ARM TrustZone CryptoCell-310 Cryptographic and security module AES 128-bit ECB/CCM/AAR hardware accelerator Digital microphone interface (PDM) Quadrature decoder 12-bit ADC Low power comparator On-chip 50Ω balun On-air compatible with nRF52, nRF51 and nRF24 Series Applications Advanced high performance wearables Wearables for secure payments Virtual Reality/Augmented Reality systems Smart Home sensor networks Smart city sensor networks High performance HID controllers Internet of Things (IoT) sensor networks Smart door locks Smart lighting networks Connected white goods
U3 = InkTime_v5:ESP32_C6_LIBRARY_MAX17048G+T10: Check availability <https://pricing.snapeda.com/parts/MAX17048G%2BT10/Analog%20Devices/view-part?ref=eda>; AVAILABILITY: In Stock; CHECK_PRICES: https://www.snapeda.com/parts/MAX17048G+T10/Analog+Devices/view-part/?ref=eda; DESCRIPTION: 3µA 1-Cell/2-Cell Fuel Gauge with ModelGauge; MF: Analog Devices; MP: MAX17048G+T10; PACKAGE: TDFN-8 Maxim; PRICE: None; PURCHASE-URL: https://www.snapeda.com/api/url_track_click_mouser/?unipart_id=329239&manufacturer=Analog Devices&part_name=MAX17048G+T10&search_term=None; SNAPEDA_LINK: https://www.snapeda.com/parts/MAX17048G+T10/Analog+Devices/view-part/?ref=snap
X1 = InkTime_v5:NORDIC_NRF_XTAL_32MHZ
X2 = InkTime_v5:NORDIC_NRF_1_XTAL_32KHZ

## Board
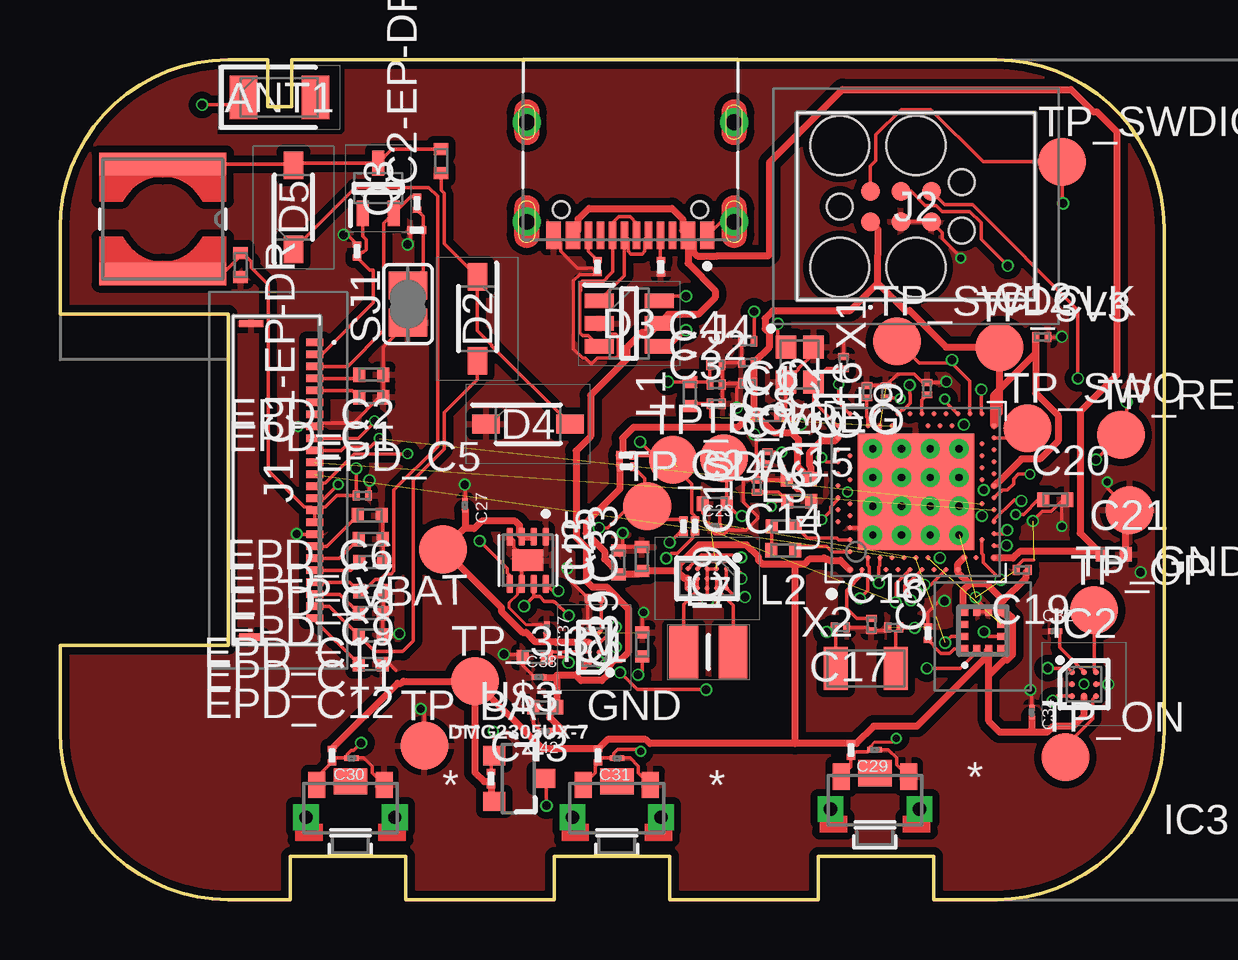
[diagram p2: board, top side]
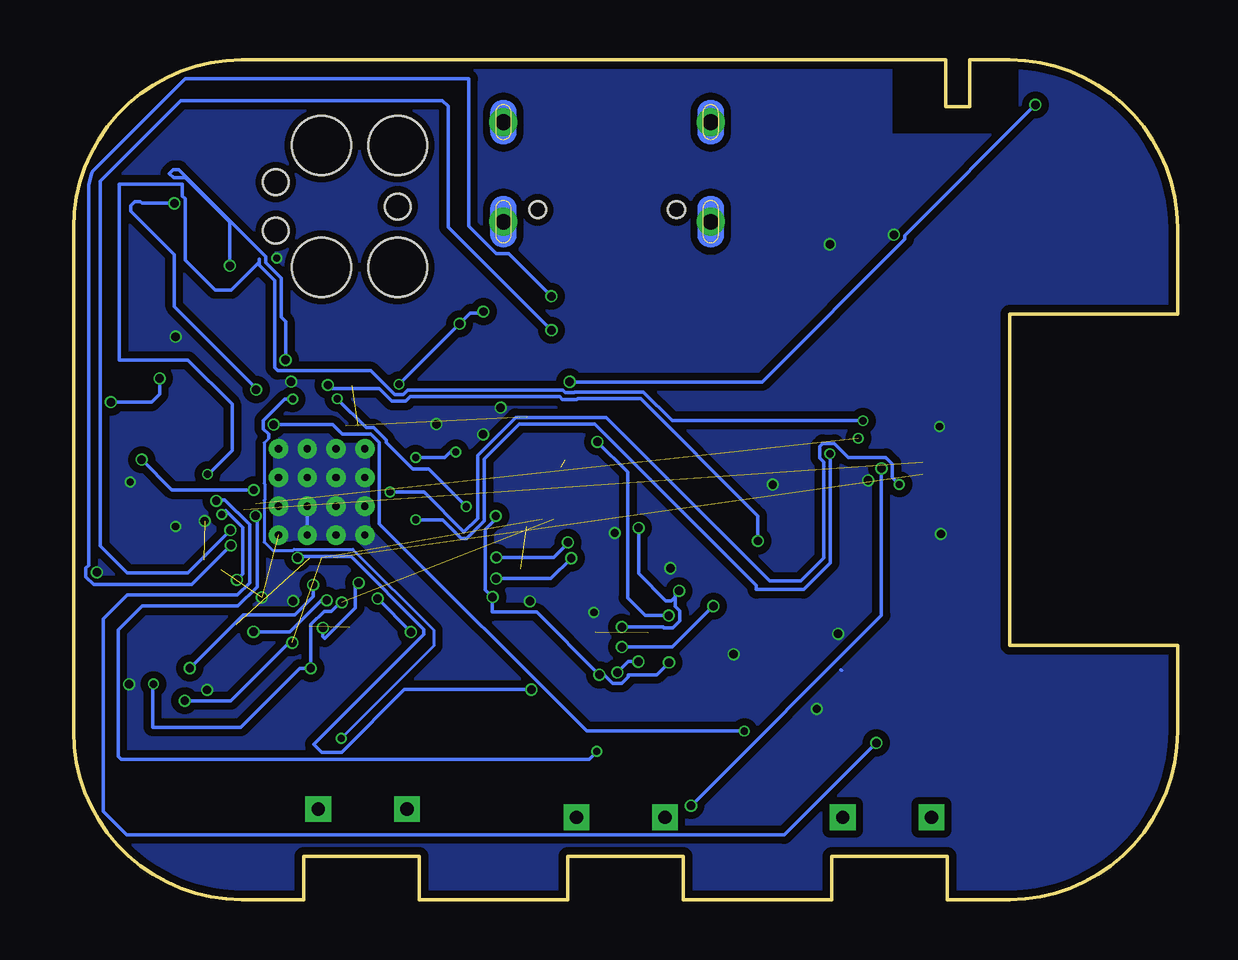
[diagram p3: board, bottom side, seen from below]

Size 46 x 35 mm. Coordinates in mm from the lower left corner, seen from the top.
Outline: 39,0 36.4,0 36.4,1.8 31.6,1.8 31.6,0 25.4,0 25.4,1.8 20.6,1.8 20.6,0 14.4,0 14.4,1.8 9.6,1.8 9.6,0 7,0 arc-90 0,7 0,10.6 7,10.6 7,24.4 0,24.4 0,28 arc-90 7,35 8.66,35 8.66,33.06 9.65,33.06 9.65,35 39,35 arc-90 46,28 46,7 arc-90 39,0
Copper layers (1*16): Top 0.035mm / dielectric 1.6mm / Bottom 0.035mm
Design rules "jlcpcb-2layers.dru": minimum track width 5mil, minimum drill 0.3mm, track to track 5mil, track to pad 5mil, pad to pad 5mil, via to via 5mil, smd to smd 5mil, copper to edge 0.2mm, drill to drill 6mil, minimum pad ring 10mil, minimum via ring 3mil, stop-mask expansion 4mil, vias tented up to drill 0mil, thermal gap 10mil

### Footprints (pad centres in the part's own frame; a part is rotated, then mirrored left to right if it is on the bottom)
2450AT18B100E_ANTC3216X140N = smd 1.15 x 1.8: 1 -1.5,0; 2 1.5,0
NORDIC_NRF_3_RESC0201_L = smd 0.28 x 0.43: 1 -0.255,0; 2 0.255,0
NORDIC_NRF_3_RESC0402_L = smd 0.5 x 0.6: 1 -0.5,0; 2 0.5,0
GRM011R60J152KE01L_2_CAPC0201X13N = smd 0.22 x 0.23: 1 -0.185,0; 2 0.185,0
ESP32_C6_LIBRARY_5_SOD3716X135N = smd 1.15 x 0.8: 1 -1.75,0; 2 1.75,0
ESP32_C6_LIBRARY_3_SOT95P280X145-6N = smd 1.2 x 0.6: 1 -1.25,0.95; 2 -1.25,0; 3 -1.25,-0.95; 4 1.25,-0.95; 5 1.25,0; 6 1.25,0.95
ESP32_C6_LIBRARY_4_ESP32_C6_LIBRARY_4_ESP32_C6_LIBRARY_4_ESP32_C6_LIBRARY_4_ESP32_WROVER_SPARKFUN-DISCRETESEMI_SOT23-3 = smd 0.8 x 0.9: 1 -0.95,-1; 2 0.95,-1; 3 0,1.1
BQ25180YBGR_BGA8C40P2X4_100X155X50 = smd 0.2 x 0.2: A1 -0.2,0.6; A2 0.2,0.6; B1 -0.2,0.2; B2 0.2,0.2; C1 -0.2,-0.2; C2 0.2,-0.2; D1 -0.2,-0.6; D2 0.2,-0.6
DRV2605YZFR_BGA9C50P3X3_144X144X62 = smd 0.25 x 0.25: A1 -0.5,0.5; A2 0,0.5; A3 0.5,0.5; B1 -0.5,0; B2 0,0; B3 0.5,0; C1 -0.5,-0.5; C2 0,-0.5; C3 0.5,-0.5
BMA423_BMA423 = smd 0.3 x 0.35: 1 -0.75,-0.775; 2 -0.25,-0.775; 3 0.25,-0.775; 4 0.75,-0.775; 7 0.75,0.775; 8 0.25,0.775; 9 -0.25,0.775; 10 -0.75,0.775 | smd 0.35 x 0.3: 5 0.775,-0.25; 6 0.775,0.25; 11 -0.775,0.25; 12 -0.775,-0.25
RT6160AWSC_BGA15C40P3X5_140X230X60 = smd 0.216 x 0.216: A1 -0.4,0.8; A2 0,0.8; A3 0.4,0.8; B1 -0.4,0.4; B2 0,0.4; B3 0.4,0.4; C1 -0.4,0; C2 0,0; C3 0.4,0; D1 -0.4,-0.4; D2 0,-0.4; D3 0.4,-0.4; E1 -0.4,-0.8; E2 0,-0.8; E3 0.4,-0.8
503480-2400_5034802400 = smd 0.3 x 0.7: 1 -5.75,1.525; 2 -5.25,1.525; 3 -4.75,1.525; 4 -4.25,1.525; 5 -3.75,1.525; 6 -3.25,1.525; 7 -2.75,1.525; 8 -2.25,1.525; 9 -1.75,1.525; 10 -1.25,1.525; 11 -0.75,1.525; 12 -0.25,1.525; 13 0.25,1.525; 14 0.75,1.525; 15 1.25,1.525; 16 1.75,1.525; 17 2.25,1.525; 18 2.75,1.525; 19 3.25,1.525; 20 3.75,1.525; 21 4.25,1.525; 22 4.75,1.525; 23 5.25,1.525; 24 5.75,1.525 | smd 0.3 x 1: MP1 -6.54,-1.125; MP2 6.54,-1.125
TC2030-IDC_TC2030IDC = smd 0.783 x 0.783: 1 -0.953,-0.635; 2 -0.953,0.635; 3 0.317,-0.635; 4 0.317,0.635; 5 1.588,-0.635; 6 1.588,0.635 | hole 2.451: -2.223,-2.54; -2.223,2.54; 0.952,-2.54; 0.952,2.54 | hole 1.067: -2.223,0; 2.857,-1.016; 2.857,1.016
KH-TYPE-C-16P_KINGHELM_KH-TYPE-C-16P = smd 0.6 x 1.15: A1_B12 -3.2,4.725; A4_B9 -2.4,4.725; A9_B4 2.4,4.725; A12_B1 3.2,4.725 | smd 0.3 x 1.15: A5 -1.25,4.725; A6 -0.25,4.725; A7 0.25,4.725; A8 1.25,4.725; B5 1.75,4.725; B6 0.75,4.725; B7 -0.75,4.725; B8 -1.75,4.725 | drill 0.65 pad 1.05: SH1 -4.32,0; SH2 4.32,0; SH3 -4.32,4.15; SH4 4.32,4.15 | hole 0.7: -2.89,3.65; 2.89,3.65
NORDIC_NRF_2_RESC0402_L = smd 0.5 x 0.6: 1 -0.5,0; 2 0.5,0
ESP32_C6_LIBRARY_2_IND_4828-WE-TPC_WRE = smd 0.9 x 5.3: 1 -2.286,0; 2 2.286,0
MLP2016SR47MT0S1_INDC2016X100N = smd 1.2 x 2.2: 1 -1.028,0; 2 1.028,0
ESP32_C6_LIBRARY_6_SOT65P210X110-3N = smd 1.05 x 0.5: 1 -1.05,0.65; 2 -1.05,-0.65; 3 1.05,0
ERA-1AEB3401C_0201 = smd 0.35 x 0.25: 1 0,0.275; 2 0,-0.275
CPF0201D7K68C1_0201 = smd 0.35 x 0.25: 1 0,0.275; 2 0,-0.275
ESP32_C6_LIBRARY_7_JUMPER_SJ = smd 1.168 x 1.6: 1 -0.762,0; 2 0.762,0
2025-10-22_07-23-44_LIBRARY_SW_EVP-AKE31A_PAN = smd 0.711 x 1.092: 1 -1.4,-0.972; 2 1.4,-0.972 | drill 0.559 pad 0.914 square: 3 -1.848,0.381; 4 1.848,0.381 | smd 1.397 x 1.092: 5 0,-1.124
HECTOR_WATCH_1_TP20R = smd 2 x 2: TP 0,0
NORDIC_NRF_4_AQFN50P700X700X85_HS-74N = smd 4.85 x 4.85: P$74 0,0 | drill 0.3 pad 0.6: P$75 -1.8,1.8; P$76 -0.6,1.8; P$77 0.6,1.8; P$78 1.8,1.8; P$79 -1.8,0.6; P$80 -0.6,0.6; P$81 0.6,0.6; P$82 1.8,0.6; P$83 -1.8,-0.6; P$84 -0.6,-0.6; P$85 0.6,-0.6; P$86 1.8,-0.6; P$87 -1.8,-1.8; P$88 -0.6,-1.8; P$89 0.6,-1.8; P$90 1.8,-1.8 | smd 0.2 x 0.2: P$A8 -1.25,3.25; P$A10 -0.75,3.25; P$A12 -0.25,3.25; P$A14 0.25,3.25; P$A16 0.75,3.25; P$A18 1.25,3.25; P$A20 1.75,3.25; P$A22 2.25,3.25; P$A23 2.75,3.25; P$AA24 3.25,-2.25; P$AB2 -2.75,-2.5; P$AC5 -2,-2.75; P$AC9 -1,-2.75; P$AC11 -0.5,-2.75; P$AC13 0,-2.75; P$AC15 0.5,-2.75; P$AC17 1,-2.75; P$AC19 1.5,-2.75; P$AC21 2,-2.75; P$AC24 3.25,-2.75; P$AD2 -2.75,-3.25; P$AD4 -2.25,-3.25; P$AD6 -1.75,-3.25; P$AD8 -1.25,-3.25; P$AD10 -0.75,-3.25; P$AD12 -0.25,-3.25; P$AD14 0.25,-3.25; P$AD16 0.75,-3.25; P$AD18 1.25,-3.25; P$AD20 1.75,-3.25; P$AD22 2.25,-3.25; P$AD23 2.75,-3.25; P$B1 -3.25,2.75; P$B3 -2.5,2.75; P$B5 -2,2.75; P$B7 -1.5,2.75; P$B9 -1,2.75; P$B11 -0.5,2.75; P$B13 0,2.75; P$B15 0.5,2.75; P$B17 1,2.75; P$B19 1.5,2.75; P$B24 3.25,2.75; P$C1 -3.25,2.25; P$D2 -2.75,2; P$D23 2.75,2; P$E24 3.25,1.75; P$F2 -2.75,1.5; P$F23 2.75,1.5; P$G1 -3.25,1.25; P$H2 -2.75,1; P$H23 2.75,1; P$J1 -3.25,0.75; P$J24 3.25,0.75; P$K2 -2.75,0.5; P$L1 -3.25,0.25; P$L24 3.25,0.25; P$M2 -2.75,0; P$N1 -3.25,-0.25; P$N24 3.25,-0.25; P$P2 -2.75,-0.5; P$P23 2.75,-0.5; P$R1 -3.25,-0.75; P$R24 3.25,-0.75; P$T2 -2.75,-1; P$T23 2.75,-1; P$U1 -3.25,-1.25; P$U24 3.25,-1.25; P$V23 2.75,-1.5; P$W1 -3.25,-1.75; P$W24 3.25,-1.75; P$Y2 -2.75,-2; P$Y23 2.75,-2
ESP32_C6_LIBRARY_SON50P200X200X80-9N = smd 0.76 x 0.27: 1 -0.985,0.75; 2 -0.985,0.25; 3 -0.985,-0.25; 4 -0.985,-0.75; 5 0.985,-0.75; 6 0.985,-0.25; 7 0.985,0.25; 8 0.985,0.75 | smd 0.9 x 1.3: 9 0,0
NORDIC_NRF_BT-XTAL_2016_N = smd 0.95 x 0.85: 1 -0.725,-0.575; 2 0.725,-0.575; 3 0.725,0.575; 4 -0.725,0.575
NORDIC_NRF_1_XTAL_3215_N = smd 1 x 1.8: 1 -1.25,0; 2 1.25,0

### Placement (x,y rotation side)
ANT1  9.14,33.44 0 top
C1  28.66,23.27 180 top
C1-EP-DR  7.52,26.45 270 top
C2  32.65,22.38 90 top
C2-EP-DR  15.88,30.78 90 top
C3  27.34,20.67 0 top
C4  27.33,22.29 0 top
C5  33.81,11.46 270 top
C6  29.52,20.2 0 top
C7  28.65,21.51 180 top
C8  28.66,22.38 180 top
C9  36.13,21.29 90 top
C10  29.05,17.24 90 top
C11  33.62,21.17 90 top
C12  40.91,23.45 0 top
C13  29.48,18.41 270 top
C14  30.78,17.52 180 top
C15  30.8,16.61 0 top
C16  34.41,21.16 90 top
C17  32.51,11.34 180 top
C18  34.75,11.35 0 top
C19  40.1,13.74 180 top
C20  41.47,16.67 0 top
C21  43.9,14.39 0 top
C22  27.34,21.47 0 top
C23  27.29,15.56 0 top
C24  27.28,16.49 0 top
C25  23.27,14.06 90 top
C27  16.88,16.44 270 top
C29  33.94,6.25 180 top
C30  12.15,5.9 180 top
C31  23.21,5.9 180 top
C32  41.47,11.18 0 top
C33  24.24,14.2 90 top
C34  40.49,7.82 270 top
C37  20.28,11.29 269.1 top
C38  19.96,9.27 0 top
C39  24.26,10.64 90 top
C42  20.21,7.02 180 top
C43  20.21,8.02 180 top
D2  17.39,24.21 270 top
D3  23.71,24.01 0 top
D4  19.5,19.82 0 top
D5  9.73,28.86 90 top
DMG2305UX-7  19.09,5.05 270 top
EPD_C1  12.97,20.94 180 top
EPD_C2  12.98,21.88 180 top
EPD_C5  12.6,16.85 0 top
EPD_C6  12.9,16.02 180 top
EPD_C7  12.94,15.02 180 top
EPD_C8  12.96,14.07 180 top
EPD_C9  12.96,12.85 180 top
EPD_C10  12.94,11.94 180 top
EPD_C11  12.95,11 180 top
EPD_C12  12.95,9.81 180 top
IC1  22.26,10.52 180 top
IC2  42.67,8.98 0 top
IC3  38.45,11.22 0 top
IC9  26.96,13.38 270 top
J1  9.1,17.48 270 top
J2  34.72,28.89 0 top
J4  23.77,32.41 180 top
L1  26.25,21.06 90 top
L2  30.14,14.55 180 top
L3  30.16,15.55 0 top
L5  4.28,28.37 270 top
L7  27.01,10.32 180 top
Q3  13.26,29.65 90 top
R1_EP_DR  14.87,29.02 180.2 top
R1_USB  25.03,26.37 180 top
R2  25.98,15.56 0 top
R2_EP_DR  12.38,27.03 0 top
R2_USB  22.4,26.38 0 top
R3  36.17,11.1 0 top
R4  26.46,15.57 0 top
R5  11.33,6 180 top
R7  32.96,6.23 180 top
R8  22.42,6 180 top
R9  22.27,12.57 90 top
R17  23.57,18.52 90 top
R18  23.61,18.04 90 top
R_PWR_EPD  17.96,5.04 0 top
R_TYPE_SEL  14.86,27.91 90 top
SJ1  14.5,24.82 90 top
SW_DN  33.96,4.15 180 top
SW_ENT  23.2,3.81 180 top
SW_UP  12.1,3.81 180 top
TP_3.3V  17.29,9.1 0 top
TP_3V3  39.15,23.03 0 top
TP_BAT_GND  15.18,6.41 0 top
TP_GND  44.56,16.23 0 top
TP_ON  41.89,5.93 0 top
TP_OP  43.09,12.06 0 top
TP_RESET  44.2,19.37 0 top
TP_SCL  25.54,18.33 0 top
TP_SDA  24.47,16.39 0 top
TP_SWDCLK  34.87,23.28 0 top
TP_SWDIO  41.75,30.76 0 top
TP_SWO  40.31,19.65 0 top
TP_VBAT  15.96,14.59 181.5 top
TP_VREG  27.66,18.39 0 top
U1  35.66,16.99 90 top
U3  19.49,14.14 270 top
U$3  19.78,10.1 180 top
X1  30.82,22.3 270 top
X2  33.58,9.64 0 top

### Tracks (layer width: path | path; a pad name or v marks a point on that pad's centre or on a via)
3V3
  Top 0.3: C19.1 40.26,13.65 40.26,13.41 39.31,12.46 | IC3.3 38.7,9.42 38.77,9.42 39.34,9.99 39.47,9.99 39.68,10.2 39.68,11.73 39.52,11.89 39.3,11.89 IC3.7 39.2,12.36 39.31,12.46 | IC3.3 38.63,10.37 38.63,10.15 35.71,7.22 33.9,7.22 33.18,6.51 R7.2 30.62,6.51 | TP_3.3V.TP 17.29,5.3 17.67,4.92 17.82,4.92 R_PWR_EPD.2 17.96,4.23 DMG2305UX-7.2 | TP_3.3V.TP 20.11,6.28 R8.2 22.82,6.68 24.4,6.68 24.57,6.51 30.62,6.51 | U1.P$A22 32.29,19.12 31.73,19.12 31.22,18.61 31.22,18.1 31.27,18.05 C14.1 | C14.1 31.33,17.52 | 31.88,14.2 31.82,14.25 | U1.P$AD14 39.03,17.37 39.07,17.37 40.07,18.37 40.84,18.37 41.58,19.12 41.58,20.18 40.65,21.11 C12.1 40.65,22.77 38.91,21.03 U1.P$AD23 39.03,19.86 39.03,20.18 39.16,20.3 TP_3V3.TP 36.93,23.03 35.4,24.55 35.21,24.55 34.07,25.7 | C6.1 28.91,20.31 C7.1 C8.1 29.54,23.01 29.54,23.63 29.38,23.79 29.38,24.23 29.69,24.54 32.9,24.54 34.07,25.7 | 25.71,13.7 C33.1 24.1,13.56 C25.1 23.27,13.61 22.69,14.19 22.69,14.51 21.93,15.28 21.93,15.71 23.33,17.12 R18.1 23.33,18.08 23.3,18.11 R17.1 23.44,18.66 23.44,19.24 23.89,19.69 28.25,19.69 28.76,20.2 C6.1 | 25.71,13.7 26,13.4 26.15,13.4 IC9.E2 IC9.E3 | 25.71,13.7 25.78,13.77 25.78,13.94 26.62,14.79 28.6,14.79 29.11,14.28 29.11,14.14 29.27,13.98 30.61,13.98 | J2.1 34.09,27.93 34.09,26.88 34.07,26.86 34.07,25.7 | R5.2 14.07,9.02 14.22,9.02 14.3,9.1 TP_3.3V.TP | 39.31,12.46 38.62,13.16 37.9,13.16 | IC3.10 37.62,12.07 37.62,12.88 37.9,13.16 | 40.56,6.98 41.13,6.98 41.37,7.21 42.21,7.21 42.67,7.67 IC2.C2 | 40.56,6.98 40.53,7 | 40.56,6.98 40.38,6.98 | 40.38,6.98 39.16,6.98 38.7,7.43 IC3.3 | 30.61,13.98 31,13.98 31.22,14.2 31.88,14.2
  Top 0.3: C14.1 30.72,18.08 30.72,18.71 30.77,18.77 30.77,19.18 30.47,19.48 29.74,19.48 C6.1 | C34.2 40.49,7.09 40.38,6.98 | 30.61,13.98 30.61,6.52 30.62,6.51 | 37.9,13.16 37.41,13.64 U1.P$W1 37.41,13.99 U1.P$Y2 | 31.88,14.2 31.98,14.2 32.03,14.14 32.51,14.14 U1.P$B1
ALERT  (via drill 0.35)
  Top 0.15: U1.P$J24 35.07,20.4 35.14,20.4 35.44,20.7 35.44,21.05 35.4,21.09 v35.4,21.45 | U3.5 18.74,13.5 18.64,13.61 18.64,13.8 v17.48,14.95
  Bottom 0.15: v35.4,21.45 35.25,21.3 33.26,21.3 32.73,20.77 32.15,20.77 31.96,20.96 25.74,20.96 25.63,20.85 25.03,20.85 25,20.88 22.37,20.88 17.67,16.19 17.48,16 v17.48,14.95
D+  (via drill 0.35)
  Top 0.15: D3.4 25.42,23.07 v26.08,23.73 | v39.47,15.4 39.31,15.24 U1.P$AD6
  Bottom 0.15: v26.08,23.73 30.39,28.04 30.39,33.06 30.63,33.31 41.54,33.31 44.9,29.95 44.9,14.75 43.77,13.62 41.24,13.62 v39.47,15.39 v39.47,15.4
D-  (via drill 0.35)
  Top 0.15: D3.6 25.15,25.15 v26.09,25.15 | U1.P$AD4 39.42,14.74 v39.44,14.76
  Bottom 0.15: v26.09,25.15 27.87,26.93 28.39,26.93 29.53,28.07 29.53,34.22 41.34,34.22 41.37,34.2 45.21,30.37 45.25,30.27 45.38,29.8 45.38,13.93 45.48,13.83 45.48,13.45 45.16,13.13 41.08,13.13 v39.44,14.76
DEC1
  Top 0.15: U1.P$C1 33.41,13.53 32.77,12.89 32.77,12.14 33.19,11.72 C5.1
DEC3
  Top 0.15: U1.P$D23 33.66,20.07 33.61,20.12 33.61,20.37 33.62,20.38 C11.1
DEC4_6  (via drill 0.3)
  Top 0.15: U1.P$E24 33.91,20.4 C16.1 34.88,20.91 34.91,20.87 v35.01,20.87 | C10.1 29.93,16.98 C15.1 | C15.1 30.3,15.92 L3.2 31.14,15.07 32.37,15.07 32.46,14.99 U1.P$B5 | C15.1 29.87,16.61 v29.64,16.38
  Bottom 0.15: v35.01,20.87 33.81,19.68 33.5,19.68 32.98,19.16 32.98,19.05 31.87,17.95 31.2,17.95 v29.64,16.38
DN
  Top 0.15: J4.B7 24.37,27.53 24.37,27.02 24.25,26.91 23.79,26.91 23.67,27.02 23.67,27.53 J4.A7 23.52,26.02 D3.1
DP
  Top 0.15: J4.A6 24.02,28.19 23.75,28.46 23.29,28.46 23.02,28.19 J4.B6 23.03,26.18 22.77,25.93 22.77,25.9 22.65,25.78 21.77,25.78 21.71,25.72 21.71,25.39 21.66,25.35 21.66,23.63 21.78,23.51 22.02,23.51 D3.3
EPD_3V3  (via drill 0.35)
  Top 0.15: L5.2 6.77,26.08 7.52,26.84 C1-EP-DR.1 7.61,26.95 7.98,26.59 7.98,26.34 8.67,25.64 8.67,17.89 10.19,16.37 10.47,16.37 J1.15 | J1.15 J1.16 | J1.15 10.77,16.37 11.05,16.37 11.53,16.85 EPD_C5.1 12.34,17.97 v12.34,17.98 | v20.27,3.91 20.27,4.97 DMG2305UX-7.3
  Bottom 0.15: v12.34,17.98 12.34,11.85 v20.27,3.91
EPD_BUSY  (via drill 0.3)
  Top 0.15: J1.9 12.43,19.23 13.11,19.91 v13.11,19.96 | U1.P$AD12 39.18,17.01 39.21,17.01 39.26,17.06 39.48,17.06 39.73,17.31 39.73,17.53 39.93,17.73 v40.41,17.73
  Bottom 0.15: v13.11,19.96 21.05,19.96 22.25,21.16 25.11,21.16 25.14,21.13 25.52,21.13 25.62,21.24 32.08,21.24 32.26,21.05 32.62,21.05 33.61,22.04 37.5,22.04 37.62,22.17 37.62,25.8 38.26,26.44 38.26,26.57 | 38.26,26.57 38.26,26.69 | 38.26,26.57 39.42,25.41 40.1,25.41 41.34,26.65 41.34,29.21 41.46,29.32 41.46,29.82 44.1,29.82 44.1,22.49 41.23,22.49 39.39,20.65 39.39,18.72 40.37,17.73 v40.41,17.73
EPD_CS  (1 unrouted)
EPD_DC  (1 unrouted)
EPD_RST  (via drill 0.3)  (1 unrouted)
  Top 0.15: J1.10 11.73,18.73 11.86,18.86 12.93,18.86 v13.3,19.23
GDR
  Top 0.15: Q3.1 12.61,27.67 12.76,27.52 12.76,27.1 12.64,26.98 12.6,26.98 R2_EP_DR.2 12.9,26.24 13.06,26.24 13.06,24.88 10.91,22.73 J1.2
GND  (via drill 0.3, 0.35)  (7 unrouted)
  Top 0.127: C12.2 41.73,23.45 v41.74,23.46 | C37.1 19.4,11.48 18.73,12.15 18.73,12.38 19.06,12.71 19.06,12.98 U3.6
  Top 0.15: J2.3 J2.5 36.76,27.8 36.76,27.54 37.53,26.78 v37.53,26.74 | J4.A12_B1 20.87,27.38 20.87,27.02 21.56,26.33 22.17,26.33 R2_USB.2 22.35,26.06 21.65,26.06 21.39,25.79 21.39,22.96 21.78,22.56 21.89,22.56 22.13,22.32 22.38,22.56 23.15,22.56 23.27,22.68 23.27,23.45 23.15,23.57 22.91,23.57 D3.2 | J4.A1_B12 27.54,28.26 J4.SH3 | U1.P$F23 34.16,19.09 U1.P$78 | C22.2 27.63,21.51 C7.2 28.2,21.32 v28.2,20.51 | C3.2 C22.2 | C22.2 C4.2 27.68,22.38 C8.2 C1.2 | C33.2 23.41,14.7 C25.2 23.45,14.74 v23.45,15.28 | C10.2 30.24,17.49 C14.2 30.27,17.47 30.69,17.05 30.85,17.05 C15.2 | C10.2 29.05,18.15 C13.2 29.31,18.32 29.18,18.32 29.02,18.49 29.02,19.17 28.93,19.26 v28.93,19.39 | C24.1 26.78,16.11 26.84,16.05 26.84,15.83 C23.1 27.17,15.5 27.17,15.36 27.29,15.24 27.67,15.24 27.85,15.41 28.6,15.41 29.08,15.89 29.08,15.97 28.47,16.57 28.47,17.5 28.48,17.51 29.03,17.51 C10.2 | v18.49,10.23 19.16,10.23 U$3.2 19.29,9.75 C38.1 | U3.4 18.9,14.96 18.9,14.68 19.04,14.54 19.09,14.54 U3.9 19.24,13.89 U3.6 | EPD_C6.1 13.44,15.97 EPD_C7.1 13.46,15 EPD_C8.1 | EPD_C9.1 13.46,11.96 EPD_C10.1 13.44,11.02 EPD_C11.1 13.53,11.08 v14.14,11.08 | X1.4 31.4,22.77 30.77,22.14 30.77,22.1 X1.2 30.25,20.43 C6.2 30.25,20.2 30.63,19.82 v30.88,19.82 | SJ1.1 13.48,23.04 EPD_C2.1 13.47,21.88 EPD_C1.1 13.3,20.95 12.23,19.87 10.77,19.87 J1.8 v9.92,19.73 | TP_BAT_GND.TP 15.18,7.8 v15.03,7.95 | IC9.B1 IC9.C1 IC9.C2 IC9.C3 26.96,12.46 v26.99,12.44 | v12.89,17.47 12.89,16.89 EPD_C5.2 | J1.17 9.88,15.23 v9.86,15.24 | IC3.9 IC3.8 38.15,12.55 v38.15,12.6 | R_TYPE_SEL.1 14.59,27.41 v14.49,27.31 | C27.1 16.88,17.28 v16.86,17.29
  Top 0.15: SW_DN.1 34.86,5.62 34.86,5.9 34.51,6.25 C29.1 | C19.2 39.84,13.87 40.13,14.16 40.58,14.16 | C42.2 19.71,7.34 C43.2 | U1.P$B7 33.56,15.49 U1.P$75 | C2.2 32.65,23.21 | R2_EP_DR.1 11.97,27.71 v11.82,27.71 | U1.P$81 U1.P$74 U1.P$84 | 14,9.54 13.73,9.81 EPD_C12.1 | C17.1 33.68,11.34 C5.2 34.35,11.21 C18.1 | C11.2 C16.2 34.9,21.9 35.59,21.9 35.94,21.55 C9.2 36.89,21.55 v36.93,21.59 | v21.13,13.81 21.13,13.43 R9.1 21.99,11.66 22.06,11.6 IC1.D2 | R3.1 36.16,11.98 36.63,12.44 v36.85,12.44 | SW_UP.1 13,5.28 13,5.56 12.66,5.9 C30.1 | C34.1 40.49,8.47 40.43,8.53 v40.43,8.74 | v43.68,8.97 43.67,8.98 IC2.B3 | v40.54,15.78 40.93,16.17 41.3,16.17 41.8,16.67 C20.2 41.75,16.45 v41.75,15.55 | C39.2 24.26,11.91 v24.32,11.97 | TP_GND.TP 43.63,17.16 v43.63,17.4 | SW_ENT.1 24.1,5.28 24.1,5.56 23.77,5.9 C31.1
  Top 0.3: C21.2 44.4,16.06 TP_GND.TP
  Bottom 0.15: 14.04,9.58 14,9.54 | 36.27,15.53 36.26,15.52 U1.P$83 U1.P$84
  other vias: 45.03,13.64
  pour Top (isolate 0.305): 11.73,31.83 11.7,31.82 6.56,31.82 6.53,31.83 6.51,31.85 6.5,31.88 6.5,36.94 -1.7,37.16 -1.7,37.16 -3.39,35.46 -3.39,-5.54 52.27,-5.54 54.47,-3.34 54.47,38.01 12.9,38.01 11.76,36.88 11.92,36.72 11.93,36.69 11.93,32.05 11.92,32.02
  pour Bottom (isolate 0.305): 6.55,32 6.55,36.91 -1.53,36.91 -1.56,36.92 -1.8,37.16 -3.44,35.53 -3.44,-1.33 -1.56,-3.2 54.11,-3.2 54.44,-2.87 54.44,37.46 53.85,36.86 53.82,36.85 11.92,36.85 11.94,36.83 11.95,36.8 11.95,31.95 11.94,31.92 11.89,31.87 11.86,31.86 6.58,31.86 6.55,31.87 6.53,31.89 6.51,31.92 6.51,31.95 6.53,31.98
HAPTIC_EN  (via drill 0.35)
  Top 0.15: IC2.A1 42.01,9.64 v41.16,9.64 | v36.02,13.12 36.29,13.12 U1.P$U1
  Bottom 0.15: v41.16,9.64 38.93,11.87 36.78,11.87 36.02,12.64 v36.02,13.12
IMU_INT1  (via drill 0.35)
  Top 0.15: IC3.5 38.7,10.97 v38.5,11.16 | U1.P$N1 35.43,13.26 35.36,13.26 35.2,13.1 35.2,12.84 35.45,12.6 v35.45,12.47
  Bottom 0.15: v38.5,11.16 36.99,11.16 35.68,12.47 v35.45,12.47
IMU_INT2  (1 unrouted)
LX1
  Top 0.15: L7.1 28.04,12.27 27.45,12.86 27.45,12.89 IC9.B3 IC9.B2
LX2
  Top 0.15: IC9.D2 IC9.D3 26.51,12.94 26.51,12.84 25.99,12.31 L7.2
MOSI  (via drill 0.3)
  Top 0.15: v32.81,16.99 U1.P$B13 | v11.59,17.31 11.01,16.73 J1.14
  Bottom 0.15: v32.81,16.99 31.4,16.99 29.73,15.33 29.17,15.89 29.17,18.51 27.57,20.1 23.8,20.1 16.98,13.28 15.71,13.28 14.75,14.24 14.75,18.24 14.91,18.41 14.91,18.89 14.79,19.01 14.3,19.01 13.72,18.43 12.15,18.43 11.88,18.16 11.88,17.59 v11.59,17.31
N$1
  Top 0.15: C32.2 41.65,10.5 IC2.A2
N$2
  Top 0.15: L5.1 9.69,30.65 D5.2 9.82,30.7 Q3.3 13.83,31.27 C2-EP-DR.2
N$3
  Top 0.15: C2.1 31.95,22.13 X1.3 31.4,20.76 U1.P$A23
N$4  (via drill 0.3, 0.35)
  Top 0.15: U1.P$B24 32.44,20.71 v32.44,21.48 | X1.1 29.91,23.36 v29.91,24.01 | C1.1 v28.92,24.51
  Bottom 0.15: v32.44,21.48 v29.91,24.01 29.47,24.45 28.99,24.45 v28.92,24.51
N$5
  Top 0.15: L3.1 29.66,14.58 L2.2
N$6
  Top 0.15: U1.P$B3 32.18,14.49 31.96,14.71 30.8,14.71 L2.1
N$7
  Top 0.15: IC3.1 37.25,10.44 37.07,10.26 36.69,10.26 36.43,10.52 36.43,10.57 R3.2
N$8  (1 unrouted)
  Top 0.15: L1.1 26.35,20.67 C3.1 27.1,20.65 27.1,20.11
N$9
  Top 0.15: C2-EP-DR.1 15.88,29.57 16.01,29.44 16.01,27.35 D2.1 17.39,23.73 18,23.12 18,23.08 D4.2
N$10  (via drill 0.3)
  Top 0.15: v31.74,18.42 31.92,18.24 U1.P$A18 | C13.1 30.06,18.66 v30.07,18.65
  Bottom 0.15: v31.74,18.42 30.53,18.42 30.3,18.65 v30.07,18.65
N$11
  Top 0.15: U1.P$N24 35.91,20.82 C9.1
N$12  (via drill 0.3, 0.35)
  Top 0.15: U1.P$AC5 38.41,14.42 38.46,14.37 38.46,14.06 v39.19,13.33 | v39.82,16.06 40.15,16.06 40.76,16.67 C20.1
  Bottom 0.15: v39.19,13.33 38.94,13.58 38.94,15.52 39.65,16.23 v39.82,16.06
N$13
  Top 0.15: R2_USB.1 22.02,27.03 J4.B5
N$14
  Top 0.15: R1_USB.2 25.02,26.66 J4.A5
N$15
  Top 0.15: J1.4 12.32,21.73 EPD_C2.2
N$16  (via drill 0.35)
  Top 0.15: IC9.D1 26.65,13.88 26.65,13.91 26.83,14.1 27.89,14.1 28.39,13.6 v28.39,13.38 | v25.26,14.23 25.47,14.44 25.72,14.44 26.36,15.08 26.36,15.19 R4.2
  Bottom 0.15: v25.26,14.23 26.11,13.38 v28.39,13.38
N$17
  Top 0.15: R9.2 22.54,11.2 IC1.D1
N$18
  Top 0.15: J1.5 12.19,21.23 EPD_C1.2
N$19  (via drill 0.35)
  Top 0.15: IC9.E1 26.25,13.88 26.25,13.91 26.71,14.37 28,14.37 28.12,14.26 v28.38,14.26 | v25.4,14.89 25.8,15.29 R2.2
  Bottom 0.15: v25.4,14.89 25.4,14.84 25.98,14.26 v28.38,14.26
N$20
  Top 0.15: SJ1.2 15.14,26.22 R_TYPE_SEL.2 15.14,28.48 R1_EP_DR.1 | R1_EP_DR.1
N$28
  Top 0.15: J1.18 11.11,14.73 EPD_C6.2
N$29
  Top 0.15: J1.19 11.64,14.23 EPD_C7.2
N$30
  Top 0.15: J1.20 12.12,13.73 EPD_C8.2
N$32
  Top 0.15: J1.22 11.65,12.73 EPD_C10.2
N$34
  Top 0.15: EPD_C12.2 10.62,11.64 J1.24
OUT+
  Top 0.15: TP_OP.TP 43.09,9.57 IC2.A3
OUT-
  Top 0.15: IC2.C3 43.02,8.34 43.02,7.52 41.89,6.39 TP_ON.TP
P0.00/XL1  (via drill 0.35)
  Top 0.15: X2.1 32.33,11.28 C17.2 32.07,11.15 v31.94,11.15 | U1.P$D2 33.66,13.92 33.71,13.87 33.71,13.44 33.67,13.39 33.67,12.88 v33.33,12.54
  Bottom 0.15: v33.33,12.54 v31.94,11.16 v31.94,11.15
P0.01/XL2  (via drill 0.35)
  Top 0.15: X2.2 34.83,11.04 34.83,11.05 34.83,11.18 C18.2 35.02,11.33 v35.61,11.33 | U1.P$F2 34.16,13.92 34.11,13.87 34.11,13.3 34.12,13.29 v34.12,13.21
  Bottom 0.15: v35.61,11.33 35.61,10.97 35.53,10.89 34.26,12.16 34.26,13.07 v34.12,13.21
P0.13  (via drill 0.35)
  Top 0.15: SW_UP.2 10.7,5.1 R5.1 11.51,5.9 C30.2 11.96,6.04 12.14,6.22 12.24,6.22 v12.55,6.53 | U1.P$AD8 38.91,15.82 39.75,16.66 40.02,16.66 v40.05,16.62
  Bottom 0.15: v12.55,6.53 16.39,2.69 43.77,2.69 44.76,3.67 44.76,11.7 43.76,12.7 40.02,12.7 39.17,12.7 38.67,13.2 38.67,15.63 39.7,16.66 40.02,16.66 v40.05,16.62
P0.14  (via drill 0.3, 0.35)
  Top 0.15: SW_ENT.2 22.3,5.28 22.3,5.56 22.42,5.68 R8.1 22.58,5.9 C31.2 23.08,5.95 23.08,6.09 23.25,6.26 24.11,6.26 v24.2,6.17
  Bottom 0.15: v24.2,6.17 24.52,5.85 44.01,5.85 44.14,5.97 44.14,11.24 43.14,12.24 39.15,12.24 38.35,13.04 38.35,15.93 U1.P$AC9
  other vias: 38.41,15.99
P1.01  (via drill 0.3, 0.35)
  Top 0.15: R_PWR_EPD.1 17.96,5.87 DMG2305UX-7.1 18.09,6.98 v18.05,7.02 | U1.P$Y23 v37.66,19.8
  Bottom 0.15: v18.05,7.02 24.61,7.02 33.26,15.66 33.26,19.04 33.61,19.4 34.8,19.4 35.2,19.8 v37.66,19.8 37.66,19.77
P1.02  (via drill 0.3)
  Top 0.127: v36.87,20.86 36.87,20.84 | C29.2 33.75,6.37 33.94,6.55 34.68,6.55 v34.84,6.72
  Top 0.15: SW_DN.2 32.96,5.52 R7.1 33.15,6.15 33.66,6.15 C29.2 | U1.P$W24 36.87,20.79 36.87,20.84
  Bottom 0.127: 37.87,19.24 37.87,19.22 38.05,19.04 38.05,17.35 38.03,17.32 38.03,16.67 38.05,16.64 38.05,14.9 37.71,14.55 36.85,14.55 36.81,14.6 34.36,14.6 31,11.24 31,10.57 v34.84,6.72
  Bottom 0.15: 37.87,19.24 37.87,19.4 38.09,19.62 38.09,19.98 37.21,20.86 v36.87,20.86
PMIC_INT  (via drill 0.35)
  Top 0.15: v23.34,9.47 24.06,8.75 v26.92,8.75
  Bottom 0.15: v23.34,9.47 22.89,9.92 IC1.A1 | v26.92,8.75 32.21,8.75 34.83,6.13 35.65,6.13 35.98,6.46 35.98,6.47 31.4,11.06 31.4,11.27 34.44,14.3 36.6,14.3 U1.P$T2
  other vias: 36.66,14.24 22.46,9.92
PREVGH
  Top 0.15: J1.21 12.08,13.23 EPD_C9.2 12.63,12.85 13.13,13.35 13.35,13.35 13.57,13.57 13.8,13.57 13.91,13.69 13.91,17.07 15.73,18.89 15.73,29.32 15.38,29.68 12.3,29.68 D5.1
PREVGL
  Top 0.15: J1.23 11.23,12.23 EPD_C11.2 13.11,10.34 14.28,10.34 14.72,10.78 14.72,17.49 16.01,18.77 16.01,20.29 17.39,21.68 D2.2
RESE
  Top 0.15: J1.3 11.98,22.23 13.5,23.74 13.5,28.19 Q3.2 14.61,29.3 R1_EP_DR.2 | R1_EP_DR.2
RESET  (via drill 0.35)
  Top 0.15: J2.6 36.87,28.96 38.02,28.96 42.41,24.57 v42.41,21.73 | v44.44,20.74 44.44,19.61 TP_RESET.TP v43.17,18.34 v43.16,18.34 | U1.P$AC13 v38.49,17.07 | v38.49,17.07
  Bottom 0.15: v43.16,18.34 41.9,17.07 v38.49,17.07 38.44,17.02 | v44.44,20.74 42.74,20.74 42.41,21.07 v42.41,21.73
RF  (via drill 0.35)
  Top 0.15: C4.1 C22.1 26.99,21.56 L1.2 26.23,21.58 v25.33,21.58 | ANT1.1 7.33,33.13 v5.92,33.13
  Bottom 0.15: v5.92,33.13 11.37,27.68 11.37,27.53 17.31,21.58 v25.33,21.58
SCK  (via drill 0.3)
  Top 0.15: v31.73,15.83 32.11,16.2 32.11,16.37 32.41,16.67 U1.P$A12 | J1.13 10.77,17.37 11.05,17.37 12.26,18.58 v14.48,18.58
  Bottom 0.15: v31.73,15.83 30.62,15.83 29.85,15.05 29.62,15.05 28.89,15.78 28.89,18.36 27.44,19.81 24.7,19.81 24.69,19.83 24.27,19.83 17.55,13.1 17.55,12.92 15.58,12.92 14.47,14.03 14.47,18.35 14.48,18.37 v14.48,18.58
SCL  (via drill 0.35)  (3 unrouted)
  Top 0.15: R4.1 26.46,15.97 26.32,16.11 26.32,17.33 25.69,17.96 | 19.74,12.63 U3.7 | 19.74,12.63 v19.34,12.23 | 19.74,12.63 19.98,12.63 20.18,12.43 20.56,12.43 20.58,12.41 20.62,12.41 v21.2,11.84 | R17.2 25.14,18.52 25.69,17.96 | 25.69,17.96 25.69,18.03 | 24.17,18.97 v24.17,19.08 24.92,18.33 TP_SCL.TP | IC2.C1 41.56,8.48 v41.37,8.29 | v36.88,10.71 37.14,10.97 IC3.12 | IC1.B1 22.95,10.32 22.98,10.35 v23.15,10.52
  Bottom 0.15: v24.17,19.08 22.91,17.82 22.91,12.58 22.17,11.84 v21.2,11.84 | v41.37,8.29 39.44,8.29 37.02,10.71 v36.88,10.71 | v19.34,12.23 21.04,10.52 v23.15,10.52
SDA  (via drill 0.3, 0.35)  (1 unrouted)
  Top 0.15: R2.1 25.02,15.84 TP_SDA.TP 24.37,16.39 | U3.8 20.52,12.87 v20.77,12.87 | v23.15,11.36 22.51,10.72 IC1.C1 | 24.37,16.39 23.72,16.39 22.82,15.49 v22.45,15.49 | R18.2 24.37,17.55 24.37,16.39 | IC3.2 38.05,10.29 38.05,10.18 37.51,9.64 v36.12,9.64 | U1.P$L1 34.85,13.18 34.85,12.42 v34.82,12.39
  Bottom 0.15: v23.15,11.36 21.42,11.36 21.4,11.33 21.02,11.33 20.74,11.61 20.74,12.03 20.93,12.21 20.93,12.62 | 20.93,12.62 20.93,12.87 | 20.93,12.87 20.93,12.88 | 20.93,12.87 v20.77,12.87 | 20.93,12.62 21.09,12.46 21.32,12.46 22.45,13.59 v22.45,15.49 | v34.82,12.39 34.89,12.39 35.26,12.02 35.56,12.02 36.12,11.46 v36.12,9.64 36.58,9.64 39.02,7.19 42.7,7.19 42.7,8.95 IC2.B2
  other vias: 42.67,8.98
SWDCLK  (via drill 0.35)
  Top 0.15: TP_SWDCLK.TP 35.8,22.36 37.17,22.36 | v39.49,26.42 38.38,27.53 38.38,28.21 37.91,28.69 36.75,28.69 36.51,28.93 36.06,28.93 35.46,29.53 J2.4 | 37.17,22.36 37.91,21.61 U1.P$AA24 | v37.17,22.5 37.17,22.36
  Bottom 0.15: v39.49,26.42 39.49,28.24 41.35,30.1 41.83,30.1 42,30.27 41.84,30.43 41.61,30.43 37.98,26.8 37.98,26.55 37.34,25.91 37.34,24.28 37.17,24.1 v37.17,22.5
SWDIO  (via drill 0.35)
  Top 0.15: J2.2 33.76,30.58 33.99,30.81 33.99,31.88 35.05,32.93 36.29,32.93 38.47,30.76 TP_SWDIO.TP 41.75,29.07 v41.8,29.02 | U1.P$AC24 38.39,20.27 v38.39,21.25 v38.39,21.26
  Bottom 0.15: v38.39,21.26 38.39,21.31 41.8,24.72 41.8,26.89 43.61,28.7 43.61,28.93 43.45,29.09 43.22,29.09 43.15,29.02 v41.8,29.02
SWO
  Top 0.15: TP_SWO.TP 39.9,19.24 U1.P$AD22
VBAT
  Top 0.3: 16.83,15.46 TP_VBAT.TP 18.39,12.17 18.39,12.01 19.26,11.14 19.42,11.14 19.45,11.11 | U3.2 U3.3 19.15,15.21 19.15,15.6 18.97,15.78 17.57,15.78 17.25,15.46 16.83,15.46 | 16.83,15.46 16.88,15.51 C27.2 | 19.45,11.11 19.81,10.75 | 19.81,10.75 19.45,11.11 | IC1.C2 20.67,10.72 20.64,10.75 20.24,10.75 | 20.24,10.75 19.81,10.75 | C37.2 20.28,10.79 20.24,10.75
VBUS
  Top 0.3: J4.A9_B4 21.59,27.91 21.59,28.37 22.03,28.81 25.51,28.81 25.95,28.37 25.95,27.91 J4.A4_B9 | 20.71,9.34 C43.1 20.4,7.7 20.4,7.59 20.96,7.03 20.96,7.02 C42.1 | 21.49,9.35 20.71,9.35 20.71,9.34 | IC1.A2 21.49,9.35 | J4.A4_B9 26.39,27.46 26.39,26.99 26.55,26.83 27.38,26.83 27.39,26.84 29.51,26.84 29.56,26.89 29.56,30.73 32.59,33.76 42.14,33.76 43.06,32.84 43.2,32.84 44.04,32.01 44.04,21.86 42.51,20.34 42.51,15.28 C21.1 43.28,14.51 39.98,14.51 39.7,14.23 39.18,14.23 39.17,14.24 U1.P$AD2 | 21.49,9.35 21.71,9.13 22.57,9.13 22.81,9.37 22.81,9.68 23.12,9.99 23.37,9.99 23.68,10.3 23.68,12.12 22.78,13.02 22.18,13.02 21.93,13.28 21.93,14.67 21.5,15.1 21.5,18.7 22.1,19.31 22.1,21.02 23.62,22.54 23.62,23.01 24.25,23.64 24.59,23.64 D3.5 25.34,24.39 26.59,24.39 27.3,25.1 27.3,25.39 26.17,26.53 J4.A4_B9 | 20.71,9.34 20.63,9.27 C38.2
VREG  (via drill 0.35)
  Top 0.15: IC1.B2 20.5,10.32 U$3.1 20.96,10.1 v21.19,9.88 | C23.2 27.48,16.2 C24.2 | C39.1 24.26,9.54 v24.09,9.37 | IC9.A1 IC9.A2 IC9.A3 28.14,12.61 v28.54,12.61 | C24.2 27.78,18.11 27.66,18.23 TP_VREG.TP | v28.41,15.99 28.28,15.99 C24.2
  Bottom 0.15: v21.19,9.88 21.7,9.37 22.89,9.37 22.89,9.28 23.15,9.01 23.53,9.01 23.88,9.37 v24.09,9.37 26.7,11.98 28.56,11.98 28.56,12.58 v28.54,12.61 28.84,12.91 28.84,15.44 28.41,15.87 v28.41,15.99